# Altium project ALLPRINT-CAPBOARD-677512.PrjPcb (part 1 of 2)
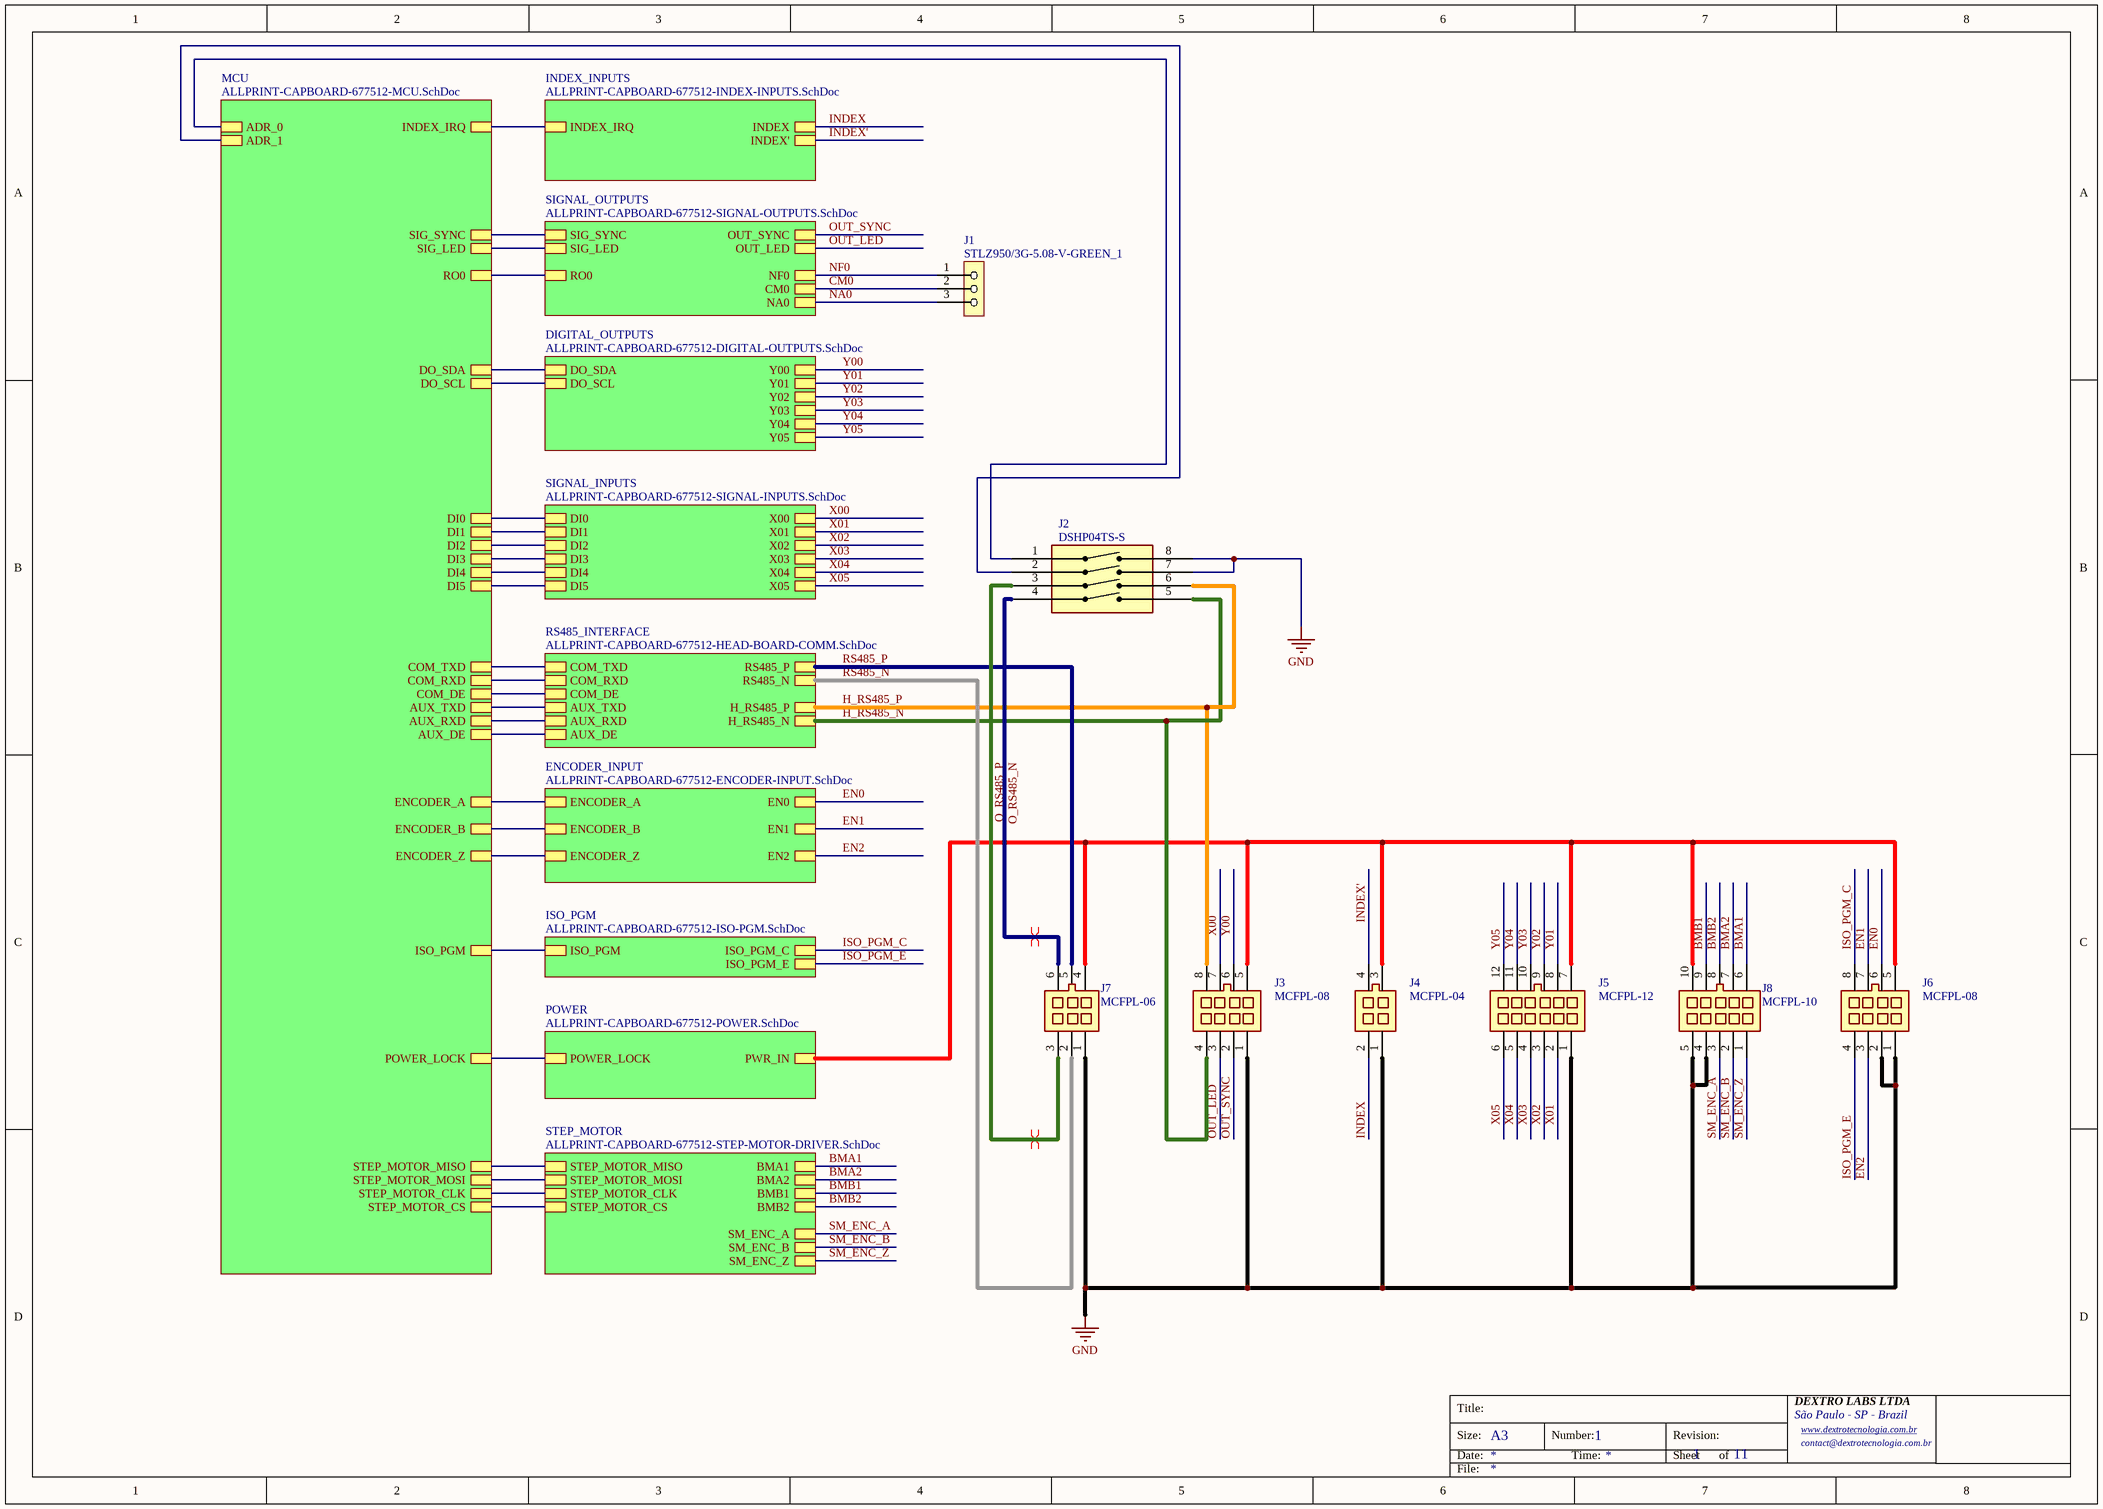
[diagram p0: ALLPRINT-CAPBOARD-677512-GENERAL.SchDoc]
11 sheets, 295 parts. Net scope: hierarchical (ports join the sheet entries above them; power ports are global).
Board file: ALLPRINT-CAPBOARD-677512.PcbDoc
Sheets:
  ALLPRINT-CAPBOARD-677512-GENERAL.SchDoc
    MCU = ALLPRINT-CAPBOARD-677512-MCU.SchDoc
    INDEX_INPUTS = ALLPRINT-CAPBOARD-677512-INDEX-INPUTS.SchDoc
    SIGNAL_INPUTS = ALLPRINT-CAPBOARD-677512-SIGNAL-INPUTS.SchDoc
    SIGNAL_OUTPUTS = ALLPRINT-CAPBOARD-677512-SIGNAL-OUTPUTS.SchDoc
    RS485_INTERFACE = ALLPRINT-CAPBOARD-677512-HEAD-BOARD-COMM.SchDoc
    POWER = ALLPRINT-CAPBOARD-677512-POWER.SchDoc
    DIGITAL_OUTPUTS = ALLPRINT-CAPBOARD-677512-DIGITAL-OUTPUTS.SchDoc
    ENCODER_INPUT = ALLPRINT-CAPBOARD-677512-ENCODER-INPUT.SchDoc
    ISO_PGM = ALLPRINT-CAPBOARD-677512-ISO-PGM.SchDoc
    STEP_MOTOR = ALLPRINT-CAPBOARD-677512-STEP-MOTOR-DRIVER.SchDoc

## Sheet ALLPRINT-CAPBOARD-677512-GENERAL.SchDoc
size A3; Organization: Altium Limited; Address1: 3 Minna Close; Address2: Belrose; Address3: NSW 2085; Address4: Australia; DocumentNumber: 1; SheetNumber: 1; SheetTotal: 11

### Parts
J1  STLZ950/3G-5.08-V-GREEN_1  [STLZ950/3G-5.08-V]
J2  DSHP04TS-S  [SW-SMD_8P-L6.7-W5.4-P1.27-LS8.5]
J3  MCFPL-08  [MCFPL-08]
J4  MCFPL-04  [MCFPL-04]
J5  MCFPL-12  [MCFPL-12]
J6  MCFPL-08  [MCFPL-08]
J7  MCFPL-06  [MCFPL-06]
J8  MCFPL-10  [MCFPL-10]

### Sub-sheets
DIGITAL_OUTPUTS = ALLPRINT-CAPBOARD-677512-DIGITAL-OUTPUTS.SchDoc: Y00, Y01, Y02, Y03, Y04, Y05, DO_SCL, DO_SDA
ENCODER_INPUT = ALLPRINT-CAPBOARD-677512-ENCODER-INPUT.SchDoc: ENCODER_A, ENCODER_B, ENCODER_Z, EN0, EN1, EN2
INDEX_INPUTS = ALLPRINT-CAPBOARD-677512-INDEX-INPUTS.SchDoc: INDEX, INDEX', INDEX_IRQ
ISO_PGM = ALLPRINT-CAPBOARD-677512-ISO-PGM.SchDoc: ISO_PGM, ISO_PGM_C, ISO_PGM_E
MCU = ALLPRINT-CAPBOARD-677512-MCU.SchDoc: INDEX_IRQ, SIG_SYNC, SIG_LED, RO0, DO_SDA, DO_SCL, DI0, DI1, DI2, DI3, DI4, DI5, COM_TXD, COM_RXD, COM_DE, ENCODER_A, ENCODER_B, ENCODER_Z, ISO_PGM, POWER_LOCK, STEP_MOTOR_MISO, STEP_MOTOR_MOSI, STEP_MOTOR_CLK, STEP_MOTOR_CS, AUX_TXD, AUX_RXD, AUX_DE, ADR_0, ADR_1
POWER = ALLPRINT-CAPBOARD-677512-POWER.SchDoc: POWER_LOCK, PWR_IN
RS485_INTERFACE = ALLPRINT-CAPBOARD-677512-HEAD-BOARD-COMM.SchDoc: COM_TXD, COM_RXD, RS485_P, RS485_N, COM_DE, H_RS485_P, H_RS485_N, AUX_TXD, AUX_RXD, AUX_DE
SIGNAL_INPUTS = ALLPRINT-CAPBOARD-677512-SIGNAL-INPUTS.SchDoc: X00, DI0, X01, DI1, X02, DI2, X03, DI3, X04, DI4, X05, DI5
SIGNAL_OUTPUTS = ALLPRINT-CAPBOARD-677512-SIGNAL-OUTPUTS.SchDoc: SIG_SYNC, OUT_SYNC, RO0, CM0, NA0, NF0, SIG_LED, OUT_LED
STEP_MOTOR = ALLPRINT-CAPBOARD-677512-STEP-MOTOR-DRIVER.SchDoc: BMA1, BMA2, BMB1, BMB2, STEP_MOTOR_CLK, STEP_MOTOR_MISO, STEP_MOTOR_MOSI, STEP_MOTOR_CS, SM_ENC_A, SM_ENC_B, SM_ENC_Z

### Nets
GND: J2.7 J2.8 J3.1 J4.1 J5.1 J6.1 J6.2 J7.1 J8.4 J8.5
BMA1: J8.6 ; sheet STEP_MOTOR/BMA1
BMA2: J8.7 ; sheet STEP_MOTOR/BMA2
BMB1: J8.9 ; sheet STEP_MOTOR/BMB1
BMB2: J8.8 ; sheet STEP_MOTOR/BMB2
CLK: sheet MCU/STEP_MOTOR_CLK, sheet STEP_MOTOR/STEP_MOTOR_CLK
CM0: J1.2 ; sheet SIGNAL_OUTPUTS/CM0
CS: sheet MCU/STEP_MOTOR_CS, sheet STEP_MOTOR/STEP_MOTOR_CS
EN0: J6.6 ; sheet ENCODER_INPUT/EN0
EN1: J6.7 ; sheet ENCODER_INPUT/EN1
EN2: J6.3 ; sheet ENCODER_INPUT/EN2
H_RS485_N: J2.5 J3.4 ; sheet RS485_INTERFACE/H_RS485_N
H_RS485_P: J2.6 J3.8 ; sheet RS485_INTERFACE/H_RS485_P
INDEX: J4.2 ; sheet INDEX_INPUTS/INDEX
INDEX': J4.4 ; sheet INDEX_INPUTS/INDEX'
ISO_PGM_C: J6.8 ; sheet ISO_PGM/ISO_PGM_C
ISO_PGM_E: J6.4 ; sheet ISO_PGM/ISO_PGM_E
MISO: sheet MCU/STEP_MOTOR_MISO, sheet STEP_MOTOR/STEP_MOTOR_MISO
MOSI: sheet MCU/STEP_MOTOR_MOSI, sheet STEP_MOTOR/STEP_MOTOR_MOSI
NA0: J1.3 ; sheet SIGNAL_OUTPUTS/NA0
NF0: J1.1 ; sheet SIGNAL_OUTPUTS/NF0
O_RS485_N: J2.4 J7.6
O_RS485_P: J2.3 J7.3
OUT_LED: J3.3 ; sheet SIGNAL_OUTPUTS/OUT_LED
OUT_SYNC: J3.2 ; sheet SIGNAL_OUTPUTS/OUT_SYNC
RS485_N: J7.2 ; sheet RS485_INTERFACE/RS485_N
RS485_P: J7.5 ; sheet RS485_INTERFACE/RS485_P
SM_ENC_A: J8.3 ; sheet STEP_MOTOR/SM_ENC_A
SM_ENC_B: J8.2 ; sheet STEP_MOTOR/SM_ENC_B
SM_ENC_Z: J8.1 ; sheet STEP_MOTOR/SM_ENC_Z
X00: J3.7 ; sheet SIGNAL_INPUTS/X00
X01: J5.2 ; sheet SIGNAL_INPUTS/X01
X02: J5.3 ; sheet SIGNAL_INPUTS/X02
X03: J5.4 ; sheet SIGNAL_INPUTS/X03
X04: J5.5 ; sheet SIGNAL_INPUTS/X04
X05: J5.6 ; sheet SIGNAL_INPUTS/X05
Y00: J3.6 ; sheet DIGITAL_OUTPUTS/Y00
Y01: J5.8 ; sheet DIGITAL_OUTPUTS/Y01
Y02: J5.9 ; sheet DIGITAL_OUTPUTS/Y02
Y03: J5.10 ; sheet DIGITAL_OUTPUTS/Y03
Y04: J5.11 ; sheet DIGITAL_OUTPUTS/Y04
Y05: J5.12 ; sheet DIGITAL_OUTPUTS/Y05
NetF1_1: J3.5 J4.3 J5.7 J6.5 J7.4 J8.10 ; sheet POWER/PWR_IN
NetJ2_1: J2.1 ; sheet MCU/ADR_0
NetJ2_2: J2.2 ; sheet MCU/ADR_1
NetR18_2: sheet MCU/INDEX_IRQ, sheet INDEX_INPUTS/INDEX_IRQ
NetR28_1: sheet MCU/POWER_LOCK, sheet POWER/POWER_LOCK
NetR30_1: sheet MCU/COM_RXD, sheet RS485_INTERFACE/COM_RXD
NetR32_1: sheet MCU/AUX_RXD, sheet RS485_INTERFACE/AUX_RXD
NetR37_2: sheet MCU/SIG_SYNC, sheet SIGNAL_OUTPUTS/SIG_SYNC
NetR42_2: sheet MCU/SIG_LED, sheet SIGNAL_OUTPUTS/SIG_LED
NetR44_1: sheet MCU/RO0, sheet SIGNAL_OUTPUTS/RO0
NetR58_1: sheet MCU/DO_SCL, sheet DIGITAL_OUTPUTS/DO_SCL
NetR59_1: sheet MCU/DO_SDA, sheet DIGITAL_OUTPUTS/DO_SDA
NetR106_1: sheet MCU/ISO_PGM, sheet ISO_PGM/ISO_PGM
NetU1_9: sheet MCU/COM_DE, sheet RS485_INTERFACE/COM_DE
NetU1_10: sheet MCU/COM_TXD, sheet RS485_INTERFACE/COM_TXD
NetU1_12: sheet MCU/DI0, sheet SIGNAL_INPUTS/DI0
NetU1_13: sheet MCU/DI1, sheet SIGNAL_INPUTS/DI1
NetU1_14: sheet MCU/DI2, sheet SIGNAL_INPUTS/DI2
NetU1_15: sheet MCU/DI3, sheet SIGNAL_INPUTS/DI3
NetU1_22: sheet MCU/AUX_TXD, sheet RS485_INTERFACE/AUX_TXD
NetU1_32: sheet MCU/DI4, sheet SIGNAL_INPUTS/DI4
NetU1_33: sheet MCU/DI5, sheet SIGNAL_INPUTS/DI5
NetU1_42: sheet MCU/ENCODER_A, sheet ENCODER_INPUT/ENCODER_A
NetU1_43: sheet MCU/ENCODER_B, sheet ENCODER_INPUT/ENCODER_B
NetU1_45: sheet MCU/ENCODER_Z, sheet ENCODER_INPUT/ENCODER_Z
NetU1_46: sheet MCU/AUX_DE, sheet RS485_INTERFACE/AUX_DE

### Layout directives
differential pair; net class DIFF120; differential pair class DIFF120: O_RS485_N, O_RS485_P

### Notes on the sheet
- Title:
- Size:
- Date:
- A3
- Number:
- Time:
- Revision:
- Sheet
- of
- DEXTRO LABS LTDA
- São Paulo - SP - Brazil
- www.dextrotecnologia.com.br <http://www.dextrotecnologia.com.br>
- contact@dextrotecnologia.com.br
- File:

### Library data of the parts
J1 = STLZ950/3G-5.08-V-GREEN: CONECTOR PHOENIX MECANO 3 VIAS PASSO 5,08mm VERDE 180º
J2 = DSHP04TS-S: 4 24V 25mA SPST 3,000 Cycles Black Slide, Recessed SMD-8P,6.7x5.4mm DIP Switches/SIP Switches ROHS; LCSC: C319050
J3 J6 = MCFPL-08: CONECTOR-METALTEX-PASSO-3mm-90 GRAUS MONTAGEM PLACA-COMPATIVEL MICROFIT-8VIAS / 5A-250VCA
J4 = MCFPL-04: CONECTOR-METALTEX-PASSO-3mm-90 GRAUS MONTAGEM PLACA-COMPATIVEL MICROFIT-4VIAS / 5A-250VCA
J5 = MCFPL-12: CONECTOR-METALTEX-PASSO-3mm-90 GRAUS MONTAGEM PLACA-COMPATIVEL MICROFIT-12VIAS / 5A-250VCA
J7 = MCFPL-06: CONECTOR-METALTEX-PASSO-3mm-90 GRAUS MONTAGEM PLACA-COMPATIVEL MICROFIT-6VIAS / 5A-250VCA
J8 = MCFPL-10: CONECTOR-METALTEX-PASSO-3mm-90 GRAUS MONTAGEM PLACA-COMPATIVEL MICROFIT-10VIAS / 5A-250VCA

## Sheet ALLPRINT-CAPBOARD-677512-MCU.SchDoc
size A3; Organization: Altium Limited; Address1: 3 Minna Close; Address2: Belrose; Address3: NSW 2085; Address4: Australia; DocumentNumber: 3; SheetNumber: 2; SheetTotal: 11
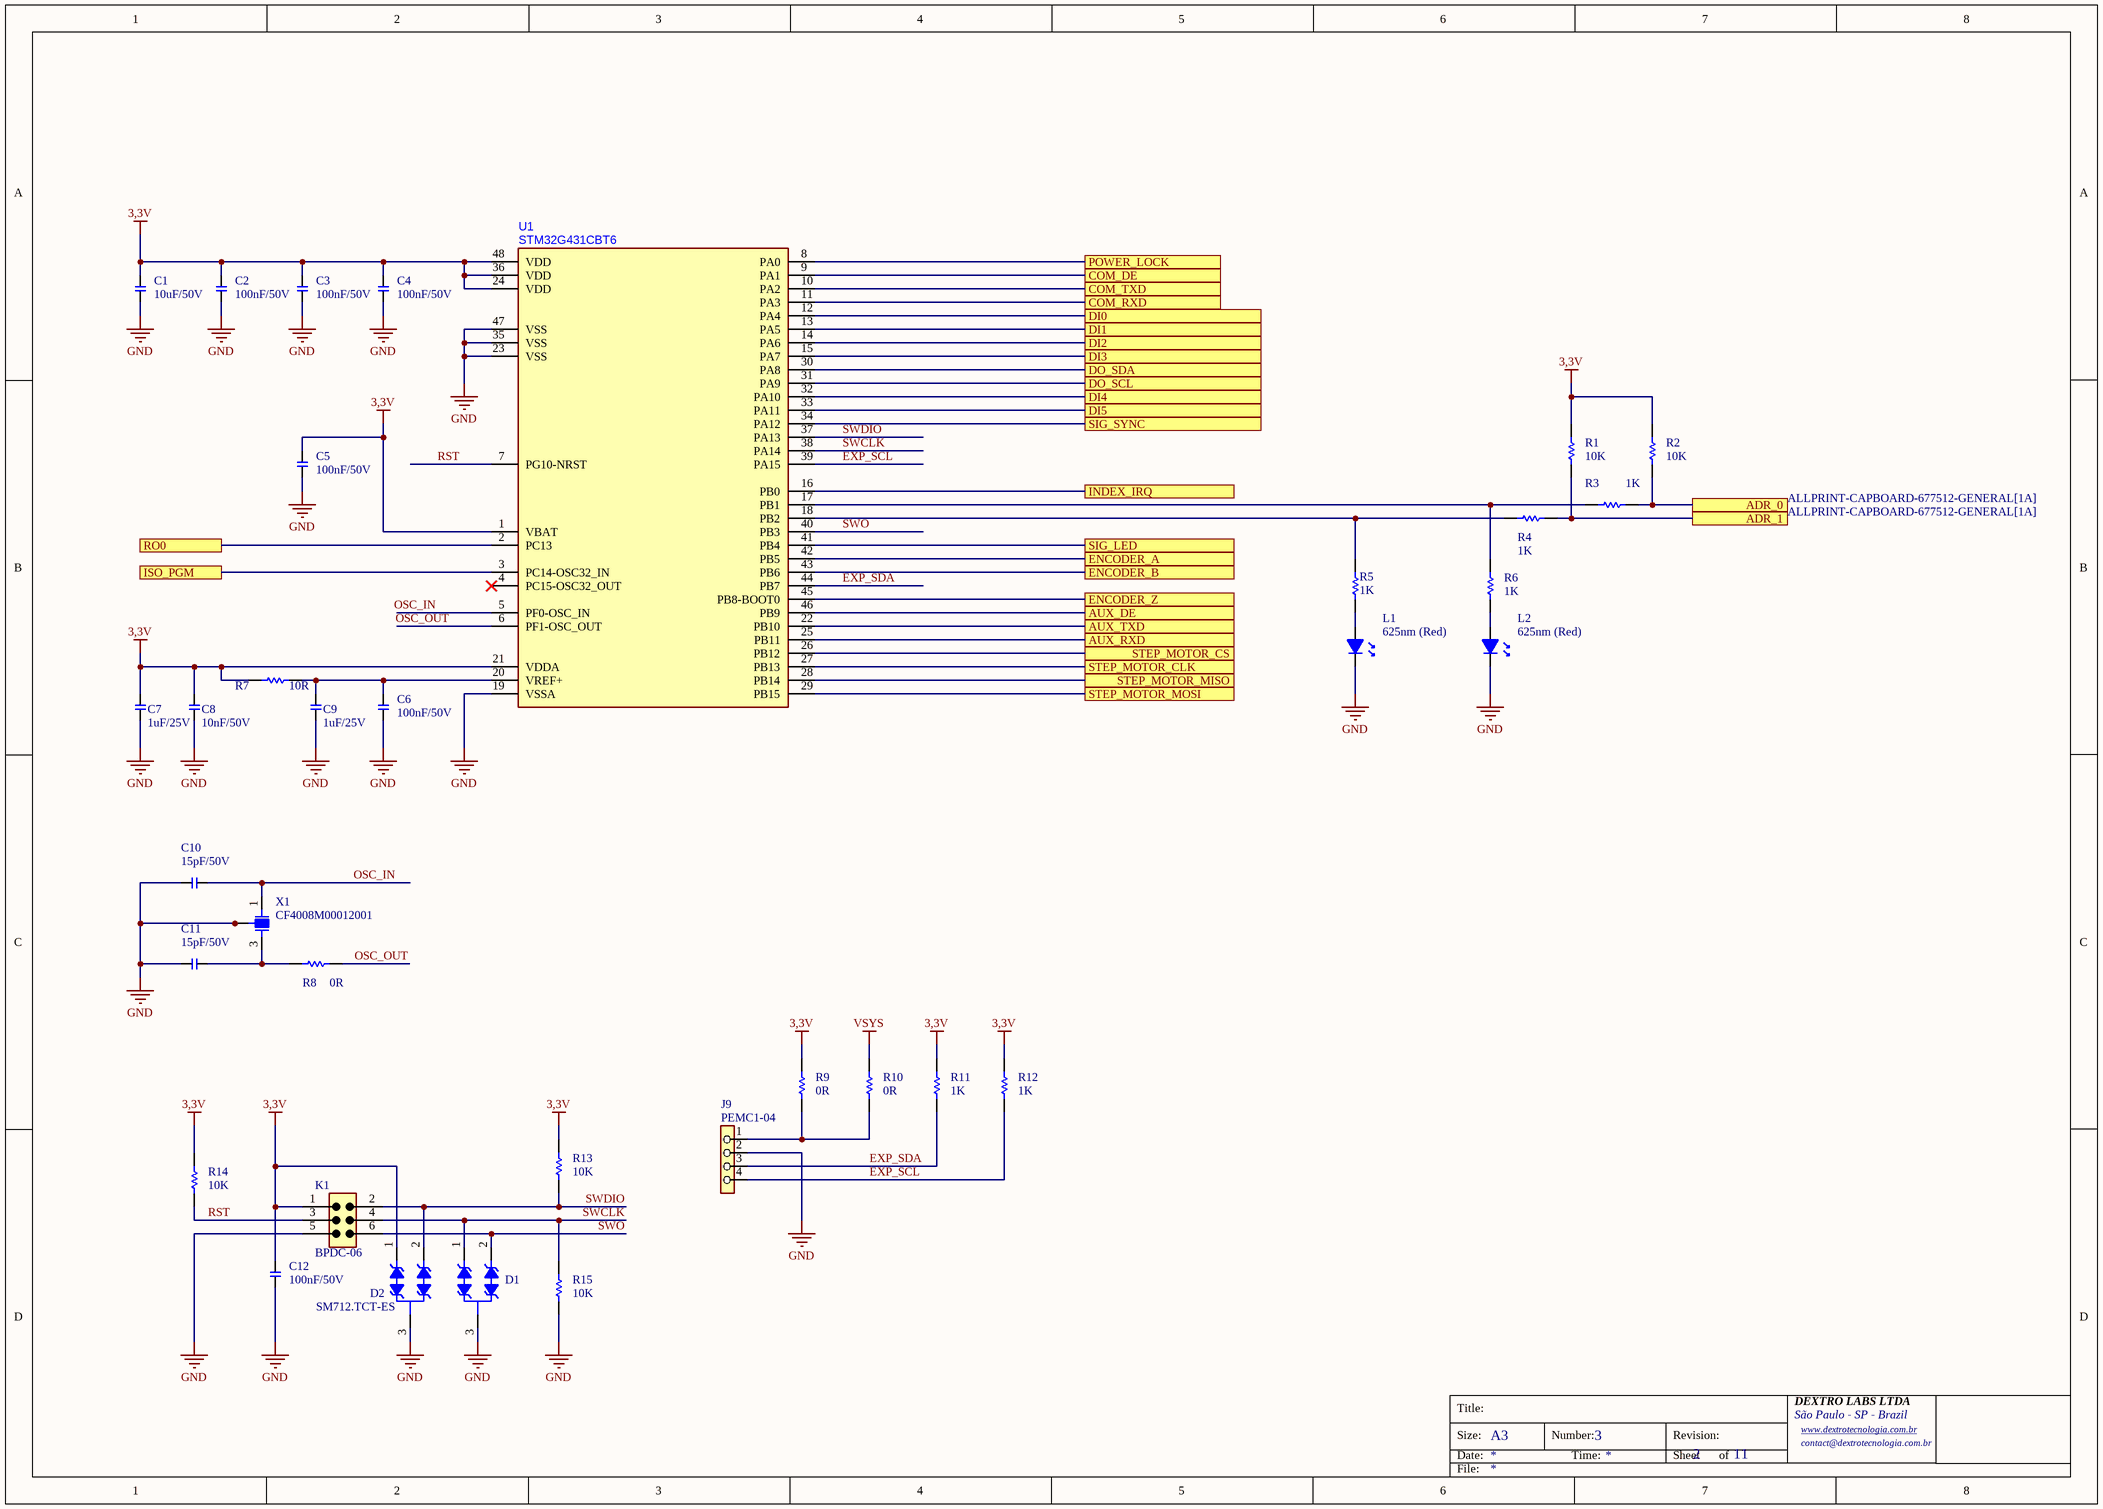
[diagram p1: ALLPRINT-CAPBOARD-677512-MCU.SchDoc]

### Parts
C1  10uF/50V  [CAP-0805]
C2  100nF/50V  [CAP-0603]
C3  100nF/50V  [CAP-0603]
C4  100nF/50V  [CAP-0603]
C5  100nF/50V  [CAP-0603]
C6  100nF/50V  [CAP-0603]
C7  1uF/25V  [CAP-0603]
C8  10nF/50V  [CAP-0603]
C9  1uF/25V  [CAP-0603]
C10  15pF/50V  [CAP-0603]
C11  15pF/50V  [CAP-0603]
C12  100nF/50V  [CAP-0603]
D1  SM712.TCT-ES  [SOT23-3]  (value not drawn)
D2  SM712.TCT-ES  [SOT23-3]
J9  PEMC1-04  [PEMC1-04]
K1  BPDC-06  [BPDC-06]
L1  Wavelength: 625nm (Red)  [LED-SMD-0603]  (hidden comment: YLED0603R)
L2  Wavelength: 625nm (Red)  [LED-SMD-0603]  (hidden comment: YLED0603R)
R1  10K  [RES-0603]
R2  10K  [RES-0603]
R3  1K  [RES-0603]
R4  1K  [RES-0603]
R5  1K  [RES-0603]
R6  1K  [RES-0603]
R7  10R  [RES-0603]
R8  0R  [RES-0603]
R9  0R  [RES-0805]
R10  0R  [RES-0805]
R11  1K  [RES-0603]
R12  1K  [RES-0603]
R13  10K  [RES-0603]
R14  10K  [RES-0603]
R15  10K  [RES-0603]
U1  STM32G431CBT6  [LQFP-48_L7.0-W7.0-P0.50-LS9.0-BL]
X1  CF4008M00012001  [TAXM8M4RDBCCT2T]

### Ports
ADR_0 (see ALLPRINT-CAPBOARD-677512-GENERAL[1A]), ADR_1 (see ALLPRINT-CAPBOARD-677512-GENERAL[1A]), AUX_DE (see ALLPRINT-CAPBOARD-677512-GENERAL[2B], ALLPRINT-CAPBOARD-677512-HEAD-BOARD-COMM[3C]), AUX_RXD (see ALLPRINT-CAPBOARD-677512-GENERAL[2B], ALLPRINT-CAPBOARD-677512-HEAD-BOARD-COMM[3C]), AUX_TXD (see ALLPRINT-CAPBOARD-677512-GENERAL[2B], ALLPRINT-CAPBOARD-677512-HEAD-BOARD-COMM[3C]), COM_DE (see ALLPRINT-CAPBOARD-677512-GENERAL[2B], ALLPRINT-CAPBOARD-677512-HEAD-BOARD-COMM[3B]), COM_RXD (see ALLPRINT-CAPBOARD-677512-GENERAL[2B], ALLPRINT-CAPBOARD-677512-HEAD-BOARD-COMM[3B]), COM_TXD (see ALLPRINT-CAPBOARD-677512-GENERAL[2B], ALLPRINT-CAPBOARD-677512-HEAD-BOARD-COMM[3B]), DI0 (see ALLPRINT-CAPBOARD-677512-GENERAL[2B], ALLPRINT-CAPBOARD-677512-SIGNAL-INPUTS[6A]), DI1 (see ALLPRINT-CAPBOARD-677512-GENERAL[2B], ALLPRINT-CAPBOARD-677512-SIGNAL-INPUTS[6B]), DI2 (see ALLPRINT-CAPBOARD-677512-GENERAL[2B], ALLPRINT-CAPBOARD-677512-SIGNAL-INPUTS[6B]), DI3 (see ALLPRINT-CAPBOARD-677512-GENERAL[2B], ALLPRINT-CAPBOARD-677512-SIGNAL-INPUTS[6C]), DI4 (see ALLPRINT-CAPBOARD-677512-GENERAL[2B], ALLPRINT-CAPBOARD-677512-SIGNAL-INPUTS[6C]), DI5 (see ALLPRINT-CAPBOARD-677512-GENERAL[2B], ALLPRINT-CAPBOARD-677512-SIGNAL-INPUTS[6D]), DO_SCL (see ALLPRINT-CAPBOARD-677512-GENERAL[2B], ALLPRINT-CAPBOARD-677512-DIGITAL-OUTPUTS[1B]), DO_SDA (see ALLPRINT-CAPBOARD-677512-GENERAL[2A], ALLPRINT-CAPBOARD-677512-DIGITAL-OUTPUTS[1B]), ENCODER_A (see ALLPRINT-CAPBOARD-677512-GENERAL[2C], ALLPRINT-CAPBOARD-677512-ENCODER-INPUT[6B]), ENCODER_B (see ALLPRINT-CAPBOARD-677512-GENERAL[2C], ALLPRINT-CAPBOARD-677512-ENCODER-INPUT[6B]), ENCODER_Z (see ALLPRINT-CAPBOARD-677512-GENERAL[2C], ALLPRINT-CAPBOARD-677512-ENCODER-INPUT[6C]), INDEX_IRQ (see ALLPRINT-CAPBOARD-677512-GENERAL[2A], ALLPRINT-CAPBOARD-677512-INDEX-INPUTS[7B]), ISO_PGM (see ALLPRINT-CAPBOARD-677512-GENERAL[2C], ALLPRINT-CAPBOARD-677512-ISO-PGM[3B]), POWER_LOCK (see ALLPRINT-CAPBOARD-677512-GENERAL[2C], ALLPRINT-CAPBOARD-677512-POWER[2D]), RO0 (see ALLPRINT-CAPBOARD-677512-GENERAL[2A], ALLPRINT-CAPBOARD-677512-SIGNAL-OUTPUTS[1D]), SIG_LED (see ALLPRINT-CAPBOARD-677512-GENERAL[2A], ALLPRINT-CAPBOARD-677512-SIGNAL-OUTPUTS[2B]), SIG_SYNC (see ALLPRINT-CAPBOARD-677512-GENERAL[2A], ALLPRINT-CAPBOARD-677512-SIGNAL-OUTPUTS[2A]), STEP_MOTOR_CLK (see ALLPRINT-CAPBOARD-677512-GENERAL[2D], ALLPRINT-CAPBOARD-677512-STEP-MOTOR-DRIVER[1A]), STEP_MOTOR_CS (see ALLPRINT-CAPBOARD-677512-GENERAL[2D], ALLPRINT-CAPBOARD-677512-STEP-MOTOR-DRIVER[1A]), STEP_MOTOR_MISO (see ALLPRINT-CAPBOARD-677512-GENERAL[2D], ALLPRINT-CAPBOARD-677512-STEP-MOTOR-DRIVER[1A]), STEP_MOTOR_MOSI (see ALLPRINT-CAPBOARD-677512-GENERAL[2D], ALLPRINT-CAPBOARD-677512-STEP-MOTOR-DRIVER[1A])

### Nets
3,3V: C1.2 C2.2 C3.2 C4.2 C5.2 C7.2 C8.2 C12.2 D2.1(A1) K1.1 R1.2 R2.2 R7.1 R9.2 R11.2 R12.2 R13.2 R14.2 U1.1(VBAT) U1.21(VDDA) U1.24(VDD) U1.36(VDD) U1.48(VDD)
GND: C1.1 C2.1 C3.1 C4.1 C5.1 C6.1 C7.1 C8.1 C9.1 C10.1 C11.1 C12.1 D1.3(K) D2.3(K) J9.2 K1.5 L1.1(K) L2.1(K) R15.1 U1.19(VSSA) U1.23(VSS) U1.35(VSS) U1.47(VSS) X1.2 X1.4
VSYS: R10.2
CLK: U1.27(PB13) ; port STEP_MOTOR_CLK
CS: U1.26(PB12) ; port STEP_MOTOR_CS
EXP_SCL: J9.4 R12.1 U1.39(PA15)
EXP_SDA: J9.3 R11.1 U1.44(PB7)
MISO: U1.28(PB14) ; port STEP_MOTOR_MISO
MOSI: U1.29(PB15) ; port STEP_MOTOR_MOSI
OSC_IN: C10.2 U1.5(PF0-OSC_IN) X1.1
OSC_OUT: R8.2 U1.6(PF1-OSC_OUT)
RST: K1.3 R14.1 U1.7(PG10-NRST)
SWCLK: D1.1(A1) K1.4 R15.2 U1.38(PA14)
SWDIO: D2.2(A2) K1.2 R13.1 U1.37(PA13)
SWO: D1.2(A2) K1.6 U1.40(PB3)
NetC6_2: C6.2 C9.2 R7.2 U1.20(VREF+)
NetC11_2: C11.2 R8.1 X1.3
NetJ2_1: R2.1 R3.2 ; port ADR_0
NetJ2_2: R1.1 R4.2 ; port ADR_1
NetJ9_1: J9.1 R9.1 R10.1
NetL1_2: L1.2(A) R5.2
NetL2_2: L2.2(A) R6.1
NetR3_1: R3.1 R6.2 U1.17(PB1)
NetR4_1: R4.1 R5.1 U1.18(PB2)
NetR18_2: U1.16(PB0) ; port INDEX_IRQ
NetR28_1: U1.8(PA0) ; port POWER_LOCK
NetR30_1: U1.11(PA3) ; port COM_RXD
NetR32_1: U1.25(PB11) ; port AUX_RXD
NetR37_2: U1.34(PA12) ; port SIG_SYNC
NetR42_2: U1.41(PB4) ; port SIG_LED
NetR44_1: U1.2(PC13) ; port RO0
NetR58_1: U1.31(PA9) ; port DO_SCL
NetR59_1: U1.30(PA8) ; port DO_SDA
NetR106_1: U1.3(PC14-OSC32_IN) ; port ISO_PGM
NetU1_9: U1.9(PA1) ; port COM_DE
NetU1_10: U1.10(PA2) ; port COM_TXD
NetU1_12: U1.12(PA4) ; port DI0
NetU1_13: U1.13(PA5) ; port DI1
NetU1_14: U1.14(PA6) ; port DI2
NetU1_15: U1.15(PA7) ; port DI3
NetU1_22: U1.22(PB10) ; port AUX_TXD
NetU1_32: U1.32(PA10) ; port DI4
NetU1_33: U1.33(PA11) ; port DI5
NetU1_42: U1.42(PB5) ; port ENCODER_A
NetU1_43: U1.43(PB6) ; port ENCODER_B
NetU1_45: U1.45(PB8-BOOT0) ; port ENCODER_Z
NetU1_46: U1.46(PB9) ; port AUX_DE

Not connected (* = marked no-connect by the designer): U1 4(PC15-OSC32_OUT)*

### Notes on the sheet
- Title:
- Size:
- Date:
- A3
- Number:
- Time:
- Revision:
- Sheet
- of
- DEXTRO LABS LTDA
- São Paulo - SP - Brazil
- www.dextrotecnologia.com.br <http://www.dextrotecnologia.com.br>
- contact@dextrotecnologia.com.br
- File:

### Library data of the parts
C1 = CAP-10uF/50V-0805-X5R-MLCC: 50V 10uF X5R ±10% 1206 Multilayer Ceramic Capacitors MLCC - SMD/SMT ROHS; LCSC: C13585
C2-C6 C12 = CAP-100nF/50V-0603-X7R-MLCC: 50V 100nF X7R ±10% 0603 Multilayer Ceramic Capacitors MLCC - SMD/SMT ROHS; LCSC: C14663
C7 C9 = CAP-1uF/25V-0603-X7R-MLCC: 25V 1uF X7R ±10% 0603 Multilayer Ceramic Capacitors MLCC - SMD/SMT ROHS; LCSC: C29936
C8 = CAP-10nF/50V-0603-X7R-MLCC: 50V 10nF X7R ±10% 0603 Multilayer Ceramic Capacitors MLCC - SMD/SMT ROHS; LCSC: C1589
C10 C11 = CAP-15pF/50V-0603-NP0-MLCC: 50V 15pF NP0 ±5% 0603 Ceramic Capacitors RoHS; LCSC: C107037
D1 D2 = SM712.TCT-ES: 400W@8/20us Bidirectional SOT-23 ESD and Surge Protection (TVS/ESD) ROHS; LCSC: C22363671
J9 = PEMC1-04: CONECTOR PASSO 2,5mm / 250VCA / 3A / 10mOHMS
K1 = BPDC-06: BARRA DE PINOS DUPLA 2,54mm 6 VIAS 180º
L1 L2 = D-LED-SMD-PKG@0603-RED: 25mA 120mcd 620nm~625nm Red 1.8V~2.4V 0603 LED Indication - Discrete RoHS; Part Number: YLED0603R; LCSC: C19171390
R1 R2 R13-R15 = RES-10K-1%-100mW-0603: 100mW Thick Film Resistor 75V ±100ppm/℃ ±1% 10kΩ 0603 Chip Resistor - Surface Mount ROHS; LCSC: C98220
R3-R6 R11 R12 = RES-1K-1%-100mW-0603: 100mW Thick Film Resistor 75V ±100ppm/℃ ±1% 1kΩ 0603 Chip Resistor - Surface Mount ROHS; LCSC: C22548
R7 = RES-10R-1%-100mW-0603: 100mW Thick Film Resistor 75V ±1% ±400ppm/℃ 10Ω 0603 Chip Resistor - Surface Mount ROHS; LCSC: C22859
R8 = RES-0R-1%-100mW-0603: 100mW 0Ω 75V Thick Film Resistor ±5% 0603 Chip Resistor - Surface Mount RoHS; LCSC: C95177
R9 R10 = RES-0R-1%-125mW-0805: 100mW Thick Film Resistor 75V ±100ppm/℃ ±1% 0R Chip Resistor - Surface Mount ROHS; LCSC: C17477
U1 = STM32G431CBT6: Manufacturer: ST(意法半导体); Add into BOM: yes; CPU Core: ARM Cortex-M Series; CPU Maximum Speed: 170MHz; Program Storage Size: 128KB; Program Memory Type: FLASH; Number of I/O: 38; ADC (Bit): 12bit; Voltage - Supply: 1.71V~3.6V; Symbol: STM32G431CBT6; Device: STM32G431CBT6; Supplier Part: C529355; Manufacturer Part: STM32G431CBT6; Supplier Footprint: LQFP-48(7x7); JLCPCB Part Class: Extended Part; Datasheet: https://item.szlcsc.com/datasheet/STM32G431CBT6/549633.html; Supplier: LCSC; Convert to PCB: yes; DAC (Bit): 12bit; Applications: -; LCSC: C529355
X1 = XTAL-8MHZ-3225-SMD: Crystal Oscillator 12pF SMD3225-4P Crystals RoHS; LCSC: C7294546

## Sheet ALLPRINT-CAPBOARD-677512-INDEX-INPUTS.SchDoc
size A3; Organization: Altium Limited; Address1: 3 Minna Close; Address2: Belrose; Address3: NSW 2085; Address4: Australia; DocumentNumber: 4; SheetNumber: 3; SheetTotal: 11
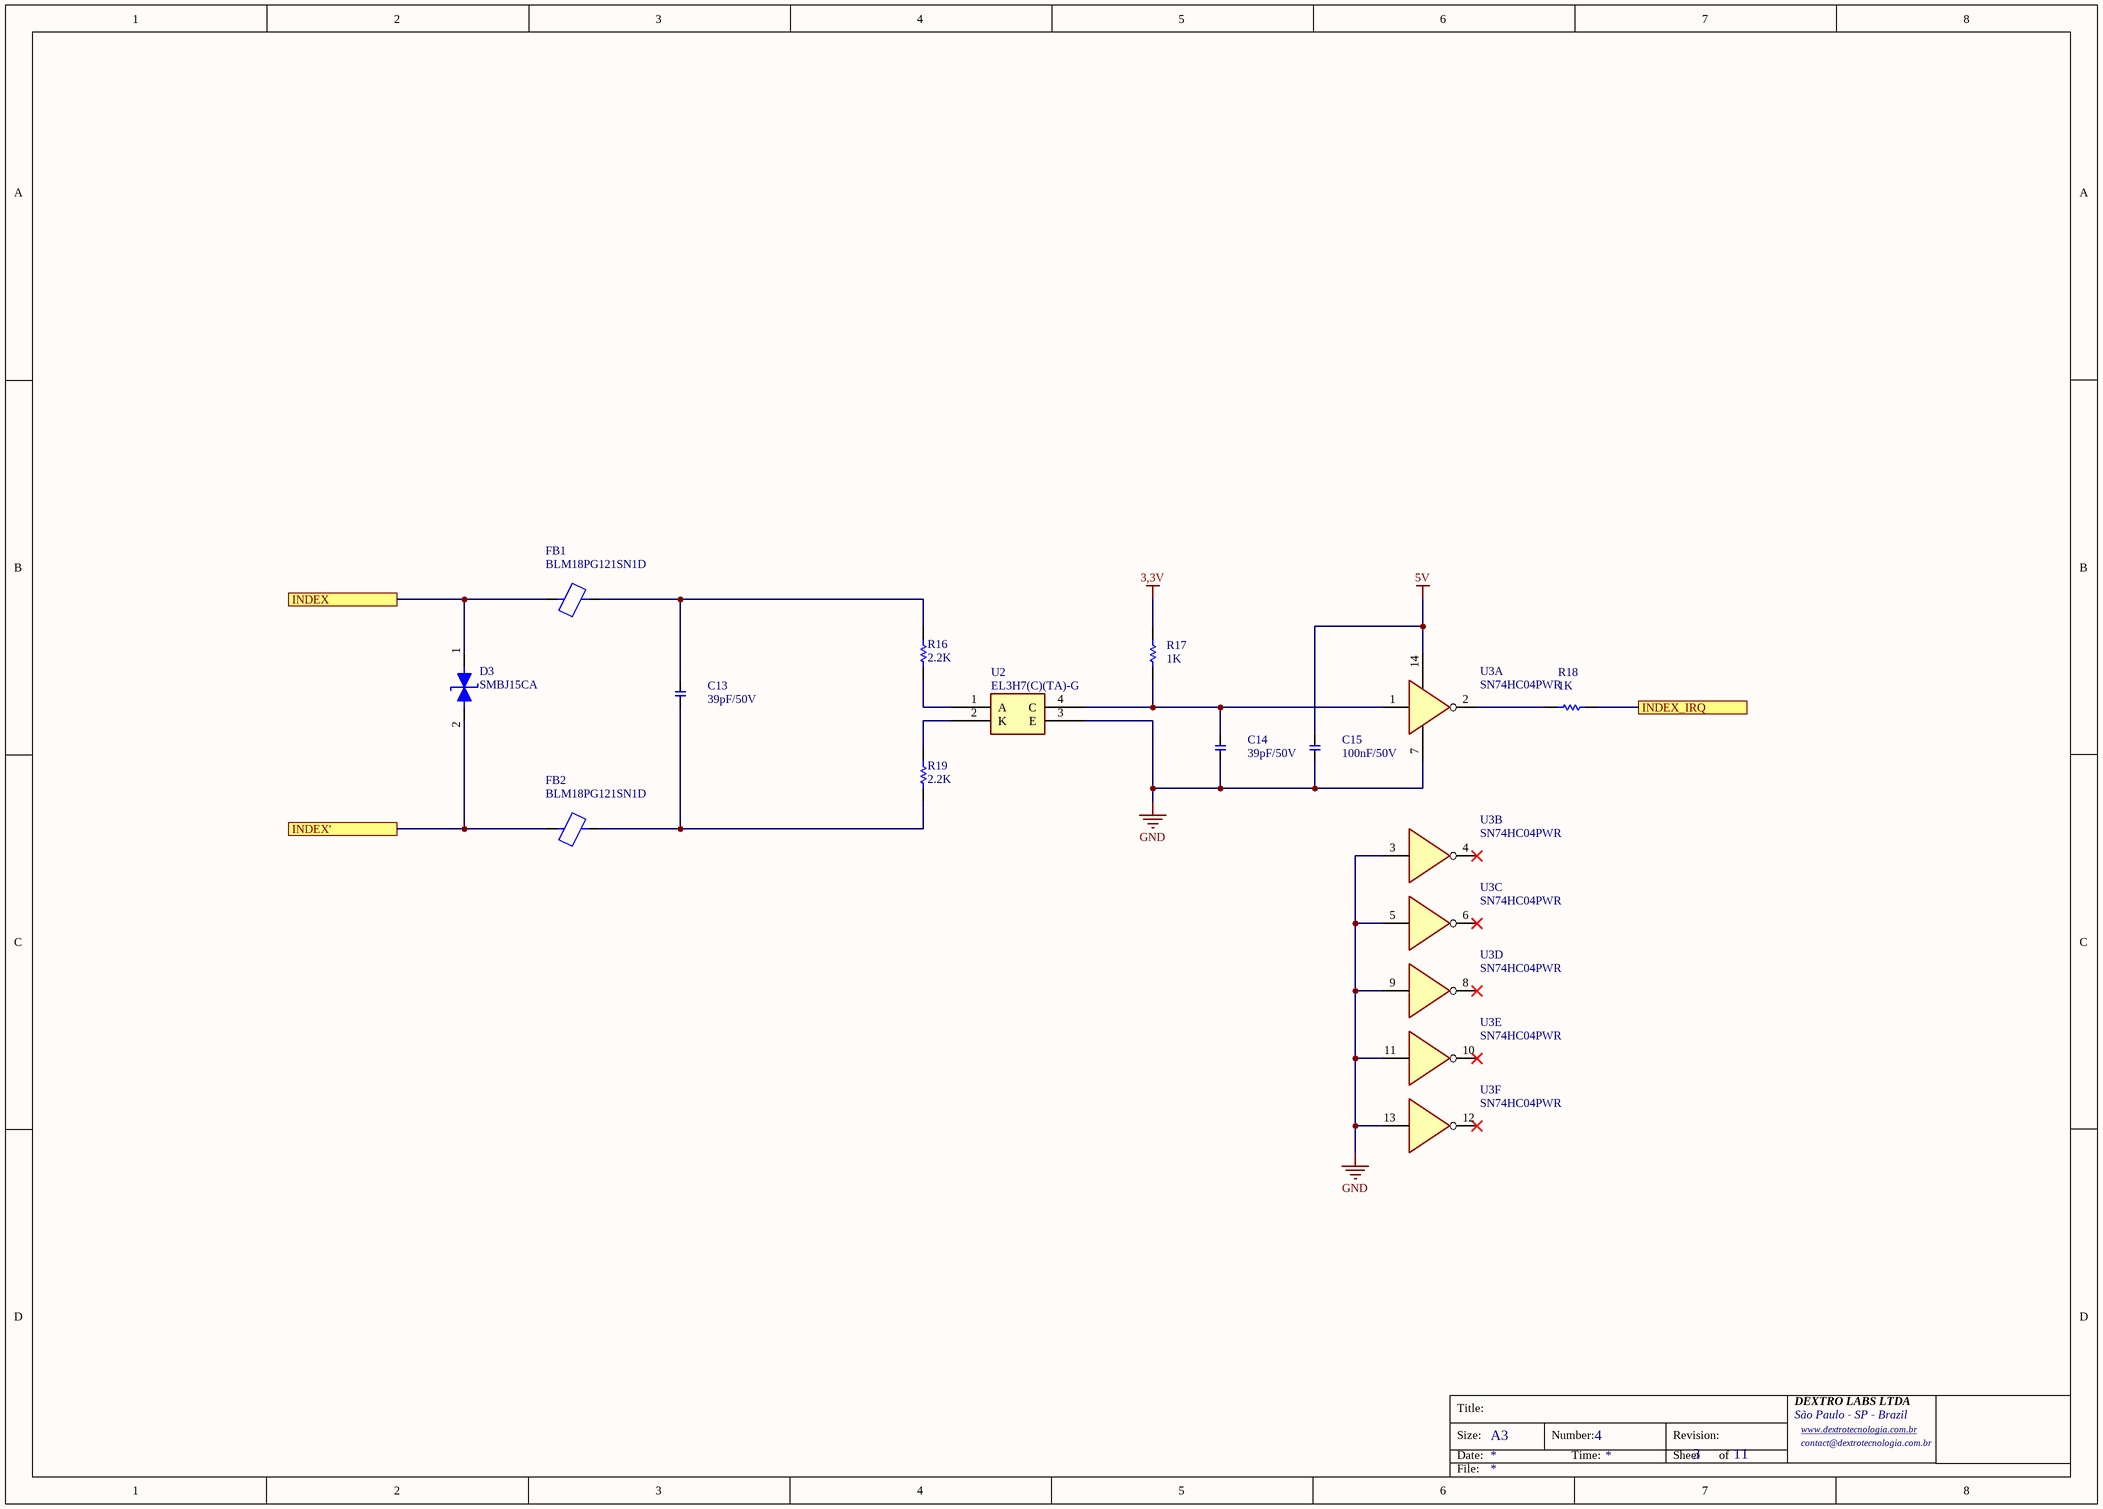
[diagram p2: ALLPRINT-CAPBOARD-677512-INDEX-INPUTS.SchDoc]

### Parts
C13  39pF/50V  [CAP-0603]
C14  39pF/50V  [CAP-0603]
C15  100nF/50V  [CAP-0603]
D3  SMBJ15CA  [DO214-AA]
FB1  BLM18PG121SN1D  [RES-0603]
FB2  BLM18PG121SN1D  [RES-0603]
R16  2.2K  [RES-0805]
R17  1K  [RES-0805]
R18  1K  [RES-0805]
R19  2.2K  [RES-0805]
U2  EL3H7(C)(TA)-G  [SSOP-4]
U3  SN74HC04PWR  [TSSOP-14]  (parts A,B,C,D,E,F of 6)

### Ports
INDEX (see ALLPRINT-CAPBOARD-677512-GENERAL[4A]), INDEX' (see ALLPRINT-CAPBOARD-677512-GENERAL[4A]), INDEX_IRQ (see ALLPRINT-CAPBOARD-677512-GENERAL[3A], ALLPRINT-CAPBOARD-677512-MCU[5B])

### Nets
3,3V: R17.2
5V: C15.2 U3.14(VCC)
GND: C14.1 C15.1 U2.3(E) U3.3(4A) U3.5 U3.7(GND) U3.9 U3.11 U3.13
INDEX: D3.1(A1) FB1.1 ; port INDEX
INDEX': D3.2(A2) FB2.1 ; port INDEX'
NetC13_1: C13.1 FB2.2 R19.1
NetC13_2: C13.2 FB1.2 R16.2
NetC14_2: C14.2 R17.1 U2.4(C) U3.1(1A)
NetR16_1: R16.1 U2.1(A)
NetR18_1: R18.1 U3.2
NetR18_2: R18.2 ; port INDEX_IRQ
NetR19_2: R19.2 U2.2(K)

Not connected (* = marked no-connect by the designer): U3 4(4Y)* 6* 8* 10* 12*

### Notes on the sheet
- Title:
- Size:
- Date:
- A3
- Number:
- Time:
- Revision:
- Sheet
- of
- DEXTRO LABS LTDA
- São Paulo - SP - Brazil
- www.dextrotecnologia.com.br <http://www.dextrotecnologia.com.br>
- contact@dextrotecnologia.com.br
- File:

### Library data of the parts
C13 C14 = CAP-39pF/50V-0603-X7R-MLCC: 50V 39pF X7R ±10% 0603 Multilayer Ceramic Capacitors MLCC - SMD/SMT ROHS; LCSC: C107049
C15 = CAP-100nF/50V-0603-X7R-MLCC: as C2 on sheet ALLPRINT-CAPBOARD-677512-MCU; LCSC: C14663
D3 = SMBJ15CA: 24.6A 600W@8/20us 24.4V 19.2V Bidirectional 15V SMB(DO-214AA) ESD and Surge Protection (TVS/ESD) ROHS; LCSC: C2760879
FB1 FB2 = BLM18PG121SN1D: FERRITE BEAD 120Ω 0603 1LN; LCSC: C14709
R16 R19 = RES-2.2K-1%-125mW-0805: 125mW 2.2kΩ 150V ±100ppm/℃ Thick Film Resistor ±1% 0805 Chip Resistor - Surface Mount ROHS; LCSC: C2907234
R17 R18 = RES-1K-1%-125mW-0805: 125mW Thick Film Resistor 150V ±100ppm/℃ ±1% 1kΩ 0805 Chip Resistor - Surface Mount ROHS; LCSC: C17513
U2 = EL3H7(C)(TA)-G: 80V 3.75kV 50mA 200mV@10mA,1mA 6V 1.2V DC SSOP-4-1.27mm Transistor, Photovoltaic Output Optoisolators ROHS; LCSC: C92243
U3 = SN74HC04PWR: 2V~6V 16ns@6V,50pF 2uA 6 1 TSSOP-14 Gates and Inverters RoHS; LCSC: C6810

## Sheet ALLPRINT-CAPBOARD-677512-SIGNAL-INPUTS.SchDoc
size A3; Organization: Altium Limited; Address1: 3 Minna Close; Address2: Belrose; Address3: NSW 2085; Address4: Australia; DocumentNumber: 8; SheetNumber: 7; SheetTotal: 11
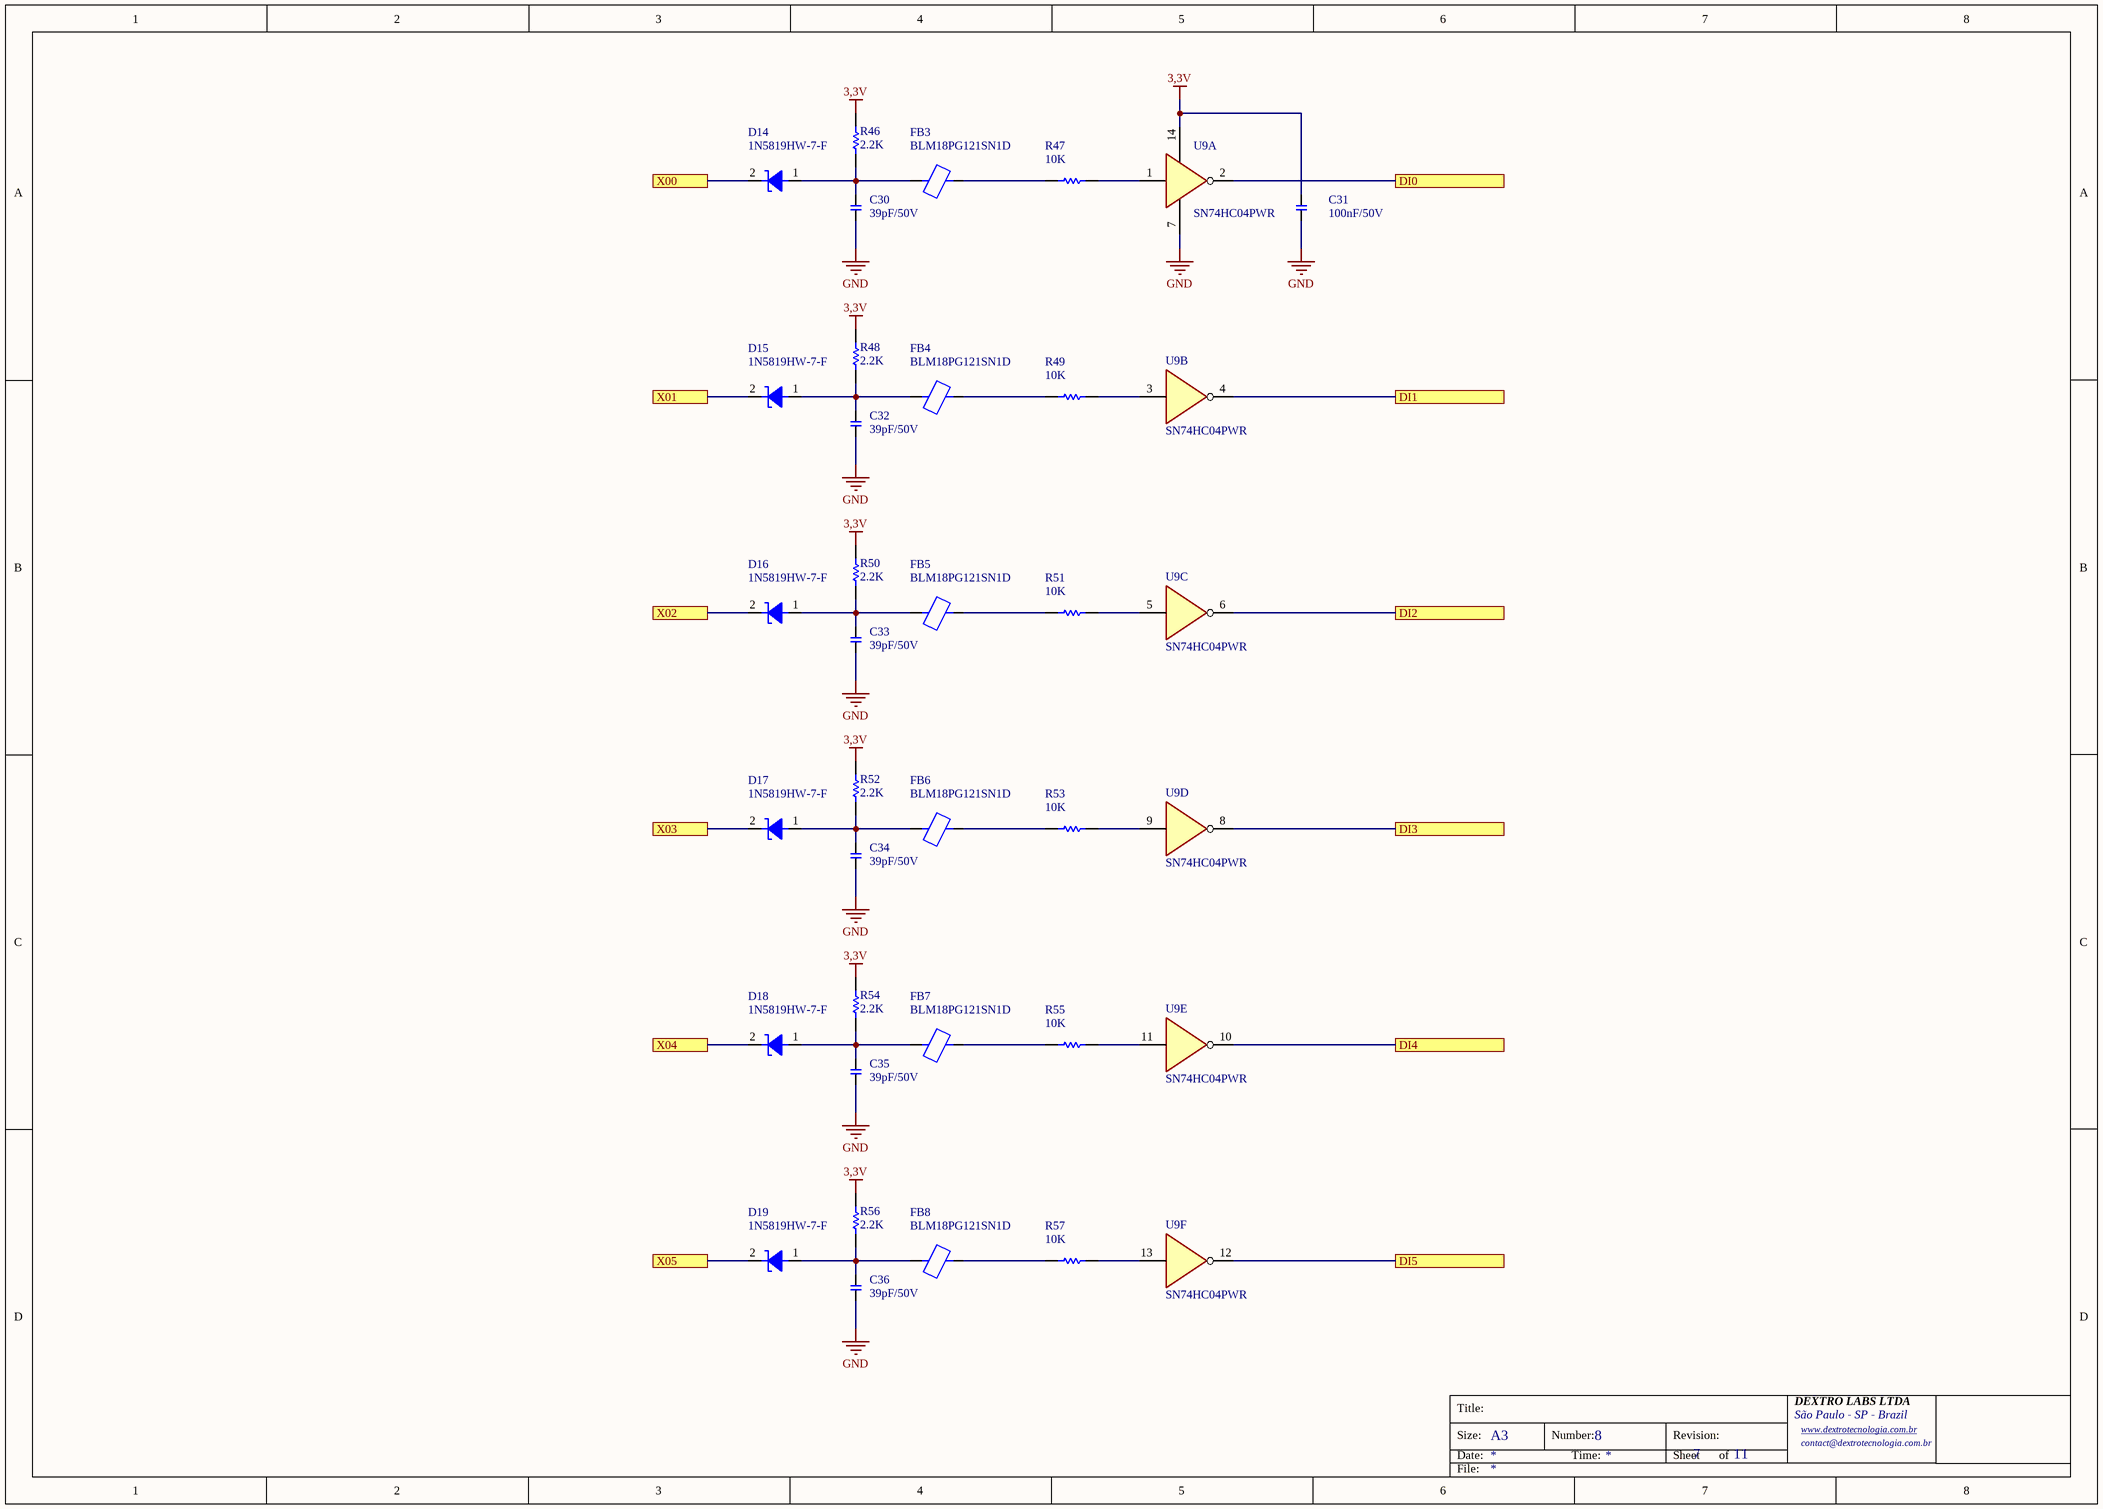
[diagram p3: ALLPRINT-CAPBOARD-677512-SIGNAL-INPUTS.SchDoc]

### Parts
C30  39pF/50V  [CAP-0603]
C31  100nF/50V  [CAP-0603]
C32  39pF/50V  [CAP-0603]
C33  39pF/50V  [CAP-0603]
C34  39pF/50V  [CAP-0603]
C35  39pF/50V  [CAP-0603]
C36  39pF/50V  [CAP-0603]
D14  1N5819HW-7-F  [SOD123]
D15  1N5819HW-7-F  [SOD123]
D16  1N5819HW-7-F  [SOD123]
D17  1N5819HW-7-F  [SOD123]
D18  1N5819HW-7-F  [SOD123]
D19  1N5819HW-7-F  [SOD123]
FB3  BLM18PG121SN1D  [RES-0603]
FB4  BLM18PG121SN1D  [RES-0603]
FB5  BLM18PG121SN1D  [RES-0603]
FB6  BLM18PG121SN1D  [RES-0603]
FB7  BLM18PG121SN1D  [RES-0603]
FB8  BLM18PG121SN1D  [RES-0603]
R46  2.2K  [RES-0805]
R47  10K  [RES-0603]
R48  2.2K  [RES-0805]
R49  10K  [RES-0603]
R50  2.2K  [RES-0805]
R51  10K  [RES-0603]
R52  2.2K  [RES-0805]
R53  10K  [RES-0603]
R54  2.2K  [RES-0805]
R55  10K  [RES-0603]
R56  2.2K  [RES-0805]
R57  10K  [RES-0603]
U9  SN74HC04PWR  [TSSOP-14]  (parts A,B,C,D,E,F of 6)

### Ports
DI0 (see ALLPRINT-CAPBOARD-677512-GENERAL[3B], ALLPRINT-CAPBOARD-677512-MCU[5A]), DI1 (see ALLPRINT-CAPBOARD-677512-GENERAL[3B], ALLPRINT-CAPBOARD-677512-MCU[5A]), DI2 (see ALLPRINT-CAPBOARD-677512-GENERAL[3B], ALLPRINT-CAPBOARD-677512-MCU[5A]), DI3 (see ALLPRINT-CAPBOARD-677512-GENERAL[3B], ALLPRINT-CAPBOARD-677512-MCU[5A]), DI4 (see ALLPRINT-CAPBOARD-677512-GENERAL[3B], ALLPRINT-CAPBOARD-677512-MCU[5B]), DI5 (see ALLPRINT-CAPBOARD-677512-GENERAL[3B], ALLPRINT-CAPBOARD-677512-MCU[5B]), X00 (see ALLPRINT-CAPBOARD-677512-GENERAL[4B]), X01 (see ALLPRINT-CAPBOARD-677512-GENERAL[4B]), X02 (see ALLPRINT-CAPBOARD-677512-GENERAL[4B]), X03 (see ALLPRINT-CAPBOARD-677512-GENERAL[4B]), X04 (see ALLPRINT-CAPBOARD-677512-GENERAL[4B]), X05 (see ALLPRINT-CAPBOARD-677512-GENERAL[4B])

### Nets
3,3V: C31.2 R46.1 R48.1 R50.1 R52.1 R54.1 R56.1 U9.14(VCC)
GND: C30.1 C31.1 C32.1 C33.1 C34.1 C35.1 C36.1 U9.7(GND)
X00: D14.2 ; port X00
X01: D15.2 ; port X01
X02: D16.2 ; port X02
X03: D17.2 ; port X03
X04: D18.2 ; port X04
X05: D19.2 ; port X05
NetC30_2: C30.2 D14.1 FB3.1 R46.2
NetC32_2: C32.2 D15.1 FB4.1 R48.2
NetC33_2: C33.2 D16.1 FB5.1 R50.2
NetC34_2: C34.2 D17.1 FB6.1 R52.2
NetC35_2: C35.2 D18.1 FB7.1 R54.2
NetC36_2: C36.2 D19.1 FB8.1 R56.2
NetFB3_2: FB3.2 R47.1
NetFB4_2: FB4.2 R49.1
NetFB5_2: FB5.2 R51.1
NetFB6_2: FB6.2 R53.1
NetFB7_2: FB7.2 R55.1
NetFB8_2: FB8.2 R57.1
NetR47_2: R47.2 U9.1(1A)
NetR49_2: R49.2 U9.3(2A)
NetR51_2: R51.2 U9.5(3A)
NetR53_2: R53.2 U9.9(4A)
NetR55_2: R55.2 U9.11(5A)
NetR57_2: R57.2 U9.13(6A)
NetU1_12: U9.2(1Y) ; port DI0
NetU1_13: U9.4(2Y) ; port DI1
NetU1_14: U9.6(3Y) ; port DI2
NetU1_15: U9.8(4Y) ; port DI3
NetU1_32: U9.10(5Y) ; port DI4
NetU1_33: U9.12(6Y) ; port DI5

### Notes on the sheet
- Title:
- Size:
- Date:
- A3
- Number:
- Time:
- Revision:
- Sheet
- of
- DEXTRO LABS LTDA
- São Paulo - SP - Brazil
- www.dextrotecnologia.com.br <http://www.dextrotecnologia.com.br>
- contact@dextrotecnologia.com.br
- File:

### Library data of the parts
C30 C32-C36 = CAP-39pF/50V-0603-X7R-MLCC: as C13 on sheet ALLPRINT-CAPBOARD-677512-INDEX-INPUTS; LCSC: C107049
C31 = CAP-100nF/50V-0603-X7R-MLCC: as C2 on sheet ALLPRINT-CAPBOARD-677512-MCU; LCSC: C14663
D14-D19 = 1N5819HW-7-F: 25A 1 Independent 40V 450mV@1A 1A SOD-123 Single Diodes RoHS; LCSC: C82544
FB3-FB8 = BLM18PG121SN1D: FERRITE BEAD 120Ω 0603 1LN; LCSC: C14709
R46 R48 R50 R52 R54 R56 = RES-2.2K-1%-125mW-0805: as R16 on sheet ALLPRINT-CAPBOARD-677512-INDEX-INPUTS; LCSC: C2907234
R47 R49 R51 R53 R55 R57 = RES-10K-1%-100mW-0603: as R1 on sheet ALLPRINT-CAPBOARD-677512-MCU; LCSC: C98220
U9 = SN74HC04PWR: as U3 on sheet ALLPRINT-CAPBOARD-677512-INDEX-INPUTS; LCSC: C6810

## Sheet ALLPRINT-CAPBOARD-677512-SIGNAL-OUTPUTS.SchDoc
size A3; Organization: Altium Limited; Address1: 3 Minna Close; Address2: Belrose; Address3: NSW 2085; Address4: Australia; DocumentNumber: 7; SheetNumber: 6; SheetTotal: 11
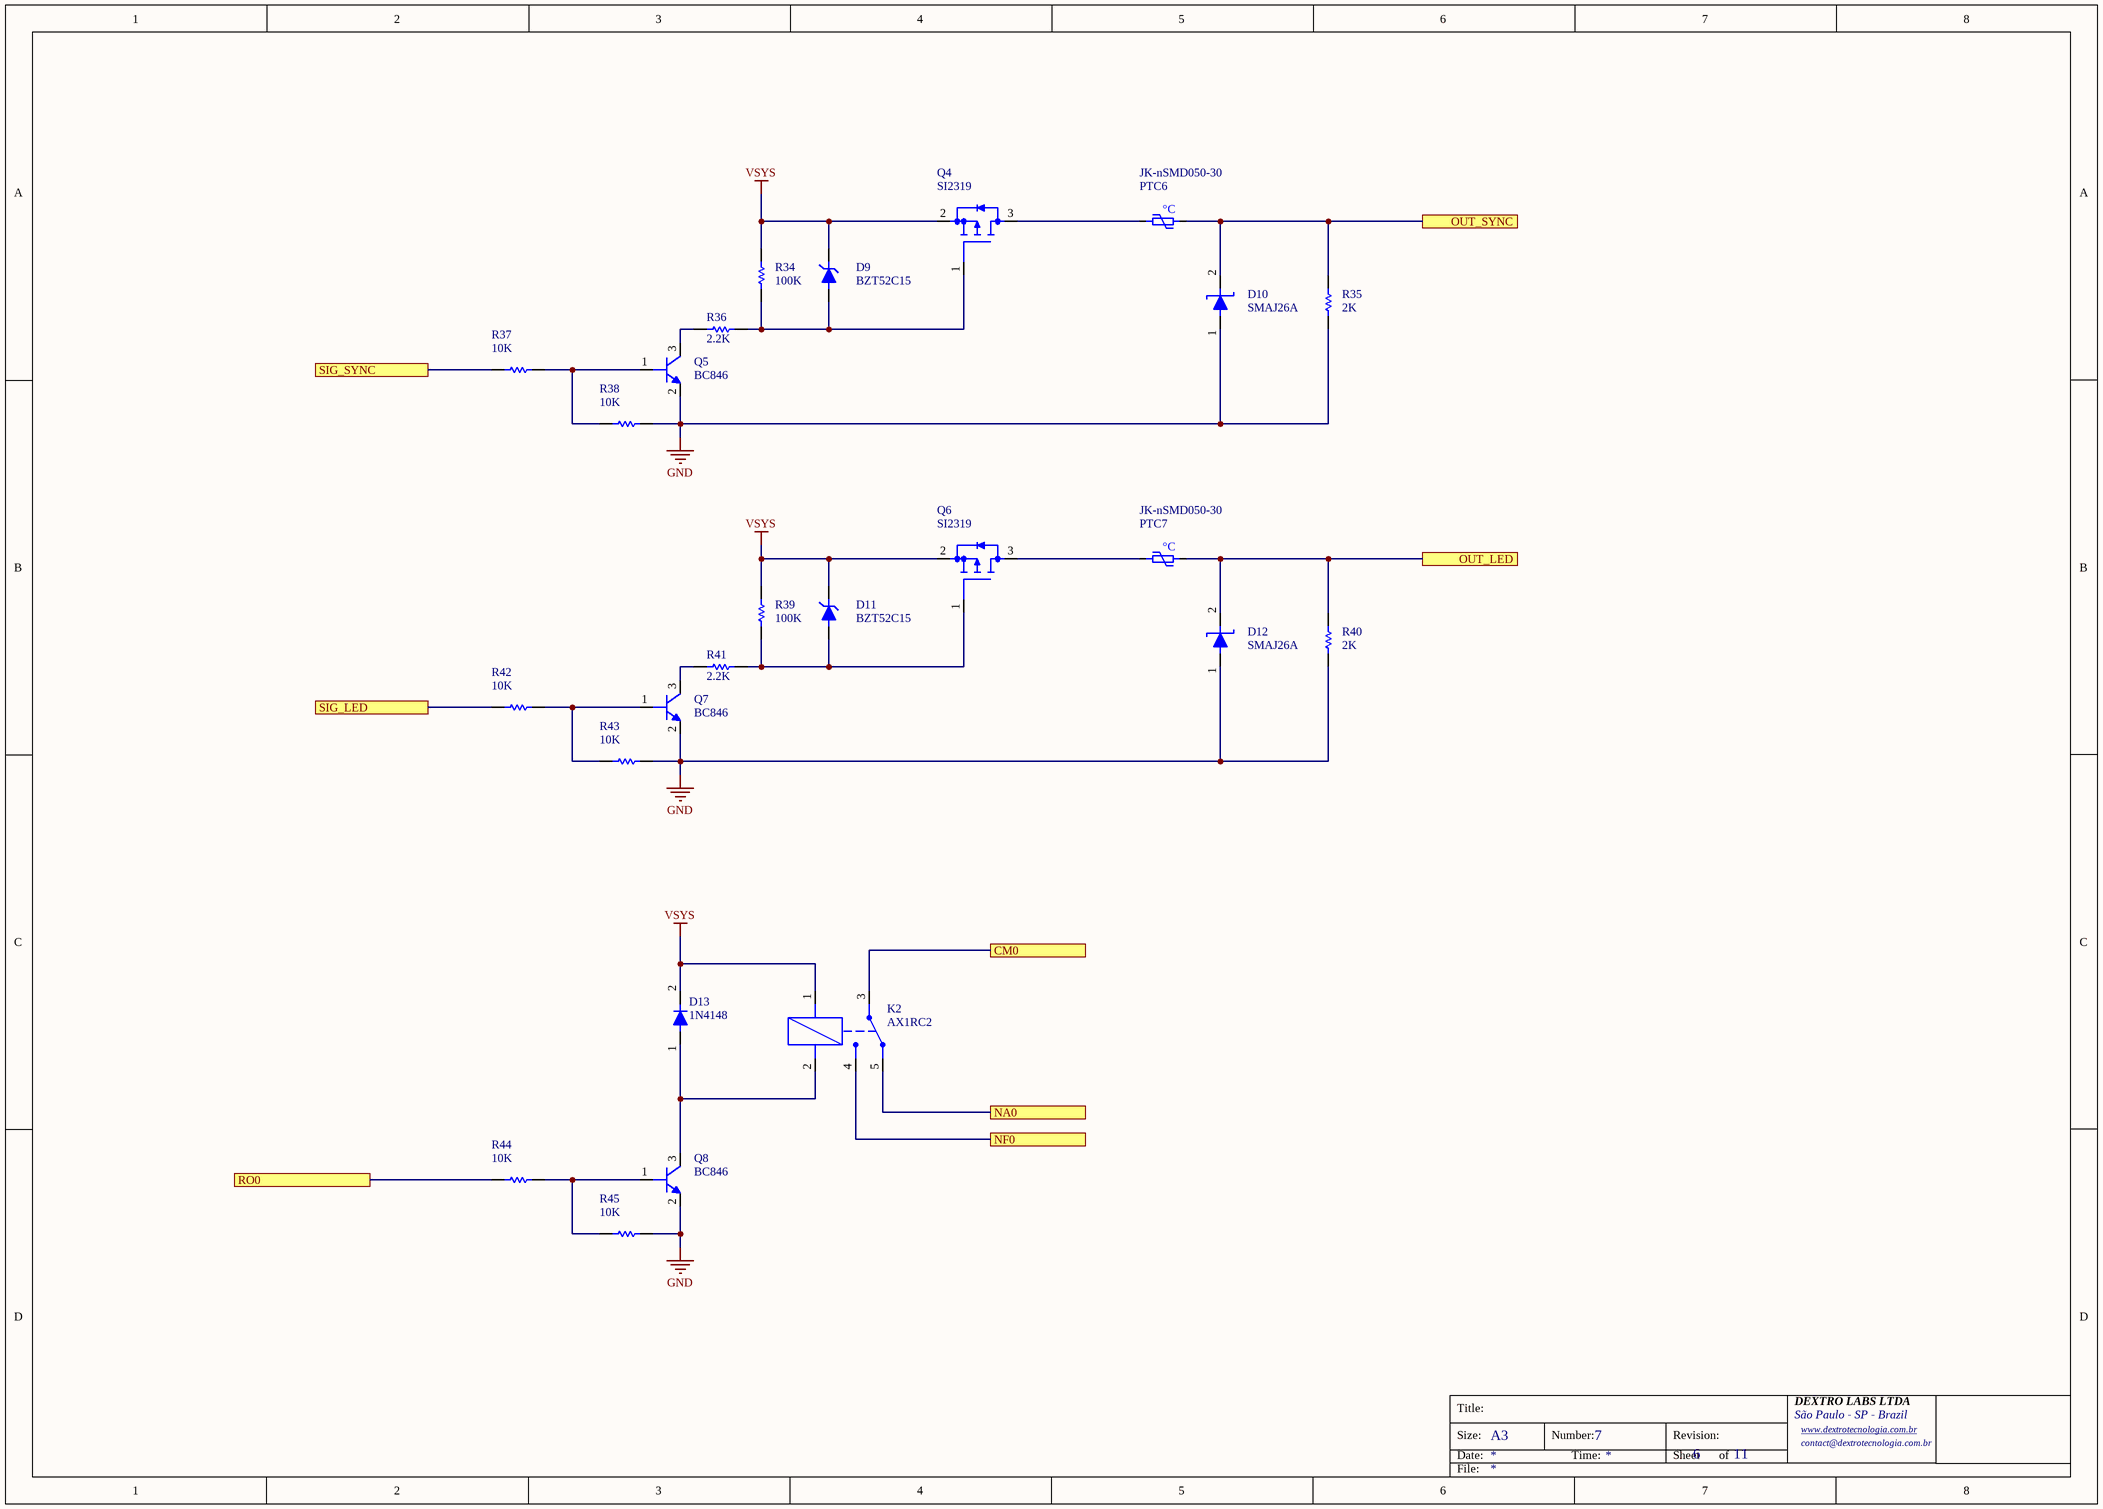
[diagram p4: ALLPRINT-CAPBOARD-677512-SIGNAL-OUTPUTS.SchDoc]

### Parts
D9  BZT52C15  [SOD123]
D10  SMAJ26A  [DO214-AC (SMA)]
D11  BZT52C15  [SOD123]
D12  SMAJ26A  [DO214-AC (SMA)]
D13  1N4148  [SOD123]
K2  AX1RC2  [METALTEX-AX1]
PTC6  JK-nSMD050-30  [PTC-1206]
PTC7  JK-nSMD050-30  [PTC-1206]
Q4  SI2319  [SOT23-3]
Q5  BC846  [SOT23-3]
Q6  SI2319  [SOT23-3]
Q7  BC846  [SOT23-3]
Q8  BC846  [SOT23-3]
R34  100K  [RES-0603]
R35  2K  [RES-1206]
R36  2.2K  [RES-0805]
R37  10K  [RES-0603]
R38  10K  [RES-0603]
R39  100K  [RES-0603]
R40  2K  [RES-1206]
R41  2.2K  [RES-0805]
R42  10K  [RES-0603]
R43  10K  [RES-0603]
R44  10K  [RES-0603]
R45  10K  [RES-0603]

### Ports
CM0 (see ALLPRINT-CAPBOARD-677512-GENERAL[4A]), NA0 (see ALLPRINT-CAPBOARD-677512-GENERAL[4A]), NF0 (see ALLPRINT-CAPBOARD-677512-GENERAL[4A]), OUT_LED (see ALLPRINT-CAPBOARD-677512-GENERAL[4A]), OUT_SYNC (see ALLPRINT-CAPBOARD-677512-GENERAL[4A]), RO0 (see ALLPRINT-CAPBOARD-677512-GENERAL[3A], ALLPRINT-CAPBOARD-677512-MCU[1B]), SIG_LED (see ALLPRINT-CAPBOARD-677512-GENERAL[3A], ALLPRINT-CAPBOARD-677512-MCU[5B]), SIG_SYNC (see ALLPRINT-CAPBOARD-677512-GENERAL[3A], ALLPRINT-CAPBOARD-677512-MCU[5B])

### Nets
GND: D10.1(A) D12.1(A) Q5.2 Q7.2 Q8.2 R35.1 R38.1 R40.1 R43.1 R45.2
VSYS: D9.2 D11.2 D13.2(K) K2.1 Q4.2(S) Q6.2(S) R34.2 R39.2
CM0: K2.3 ; port CM0
NA0: K2.5 ; port NA0
NF0: K2.4 ; port NF0
OUT_LED: D12.2(K) PTC7.2 R40.2 ; port OUT_LED
OUT_SYNC: D10.2(K) PTC6.2 R35.2 ; port OUT_SYNC
NetD9_1: D9.1 Q4.1(G]) R34.1 R36.1
NetD11_1: D11.1 Q6.1(G]) R39.1 R41.1
NetD13_1: D13.1(A1) K2.2 Q8.3
NetPTC6_1: PTC6.1 Q4.3(D)
NetPTC7_1: PTC7.1 Q6.3(D)
NetQ5_1: Q5.1 R37.1 R38.2
NetQ5_3: Q5.3 R36.2
NetQ7_1: Q7.1 R42.1 R43.2
NetQ7_3: Q7.3 R41.2
NetQ8_1: Q8.1 R44.2 R45.1
NetR37_2: R37.2 ; port SIG_SYNC
NetR42_2: R42.2 ; port SIG_LED
NetR44_1: R44.1 ; port RO0

### Notes on the sheet
- Title:
- Size:
- Date:
- A3
- Number:
- Time:
- Revision:
- Sheet
- of
- DEXTRO LABS LTDA
- São Paulo - SP - Brazil
- www.dextrotecnologia.com.br <http://www.dextrotecnologia.com.br>
- contact@dextrotecnologia.com.br
- File:
- (in symbol PTC-FUSE-30V-500mA-1206) °C

### Library data of the parts
D9 D11 = BZT52C15: DIODO ZENER 15V-500mW-SOD123; LCSC: C266569
D10 D12 = SMAJ26A: 28.9V 26V 9.5A 42.1V 400W Unidirectional DO-214AC(SMA) TVS Diodes RoHS; LCSC: C2848697
D13 = 1N4148: 1A 4ns 75V Independent 1V@50mA 150mA SOD-123 Single Diodes RoHS; LCSC: C241939
K2 = AX1RC2: RELÉ-METALTEX-BOBINA 12V-15A-SPDT
PTC6 PTC7 = PTC-FUSE-30V-500mA-1206: 30V 500mA 100A 1A 150mΩ 1206 PTC Resettable Fuses ROHS; LCSC: C720075
Q4 Q6 = SI2319: P-Channel 40V 5A 1.4W Surface Mount SOT-23; LCSC: C5337197
Q5 Q7 Q8 = TRANSISTOR-BC846B,215-SOT23: 65V 200@10mA,5V 250mW 100mA NPN SOT-23 Bipolar (BJT) ROHS; LCSC: C87062
R34 R39 = RES-100K-1%-100mW-0603: 100mW Thick Film Resistor 75V ±100ppm/℃ ±1% 100kΩ 0603 Chip Resistor - Surface Mount ROHS; LCSC: C14675
R35 R40 = RES-2K-1%-250mW-1206: 250mW Thick Film Resistor 200V ±100ppm/℃ ±5% 2kΩ 1206 Chip Resistor - Surface Mount ROHS; LCSC: C2907466
R36 R41 = RES-2.2K-1%-125mW-0805: as R16 on sheet ALLPRINT-CAPBOARD-677512-INDEX-INPUTS; LCSC: C2907234
R37 R38 R42-R45 = RES-10K-1%-100mW-0603: as R1 on sheet ALLPRINT-CAPBOARD-677512-MCU; LCSC: C98220

## Sheet ALLPRINT-CAPBOARD-677512-HEAD-BOARD-COMM.SchDoc
size A3; Organization: Altium Limited; Address1: 3 Minna Close; Address2: Belrose; Address3: NSW 2085; Address4: Australia; DocumentNumber: 6; SheetNumber: 5; SheetTotal: 11
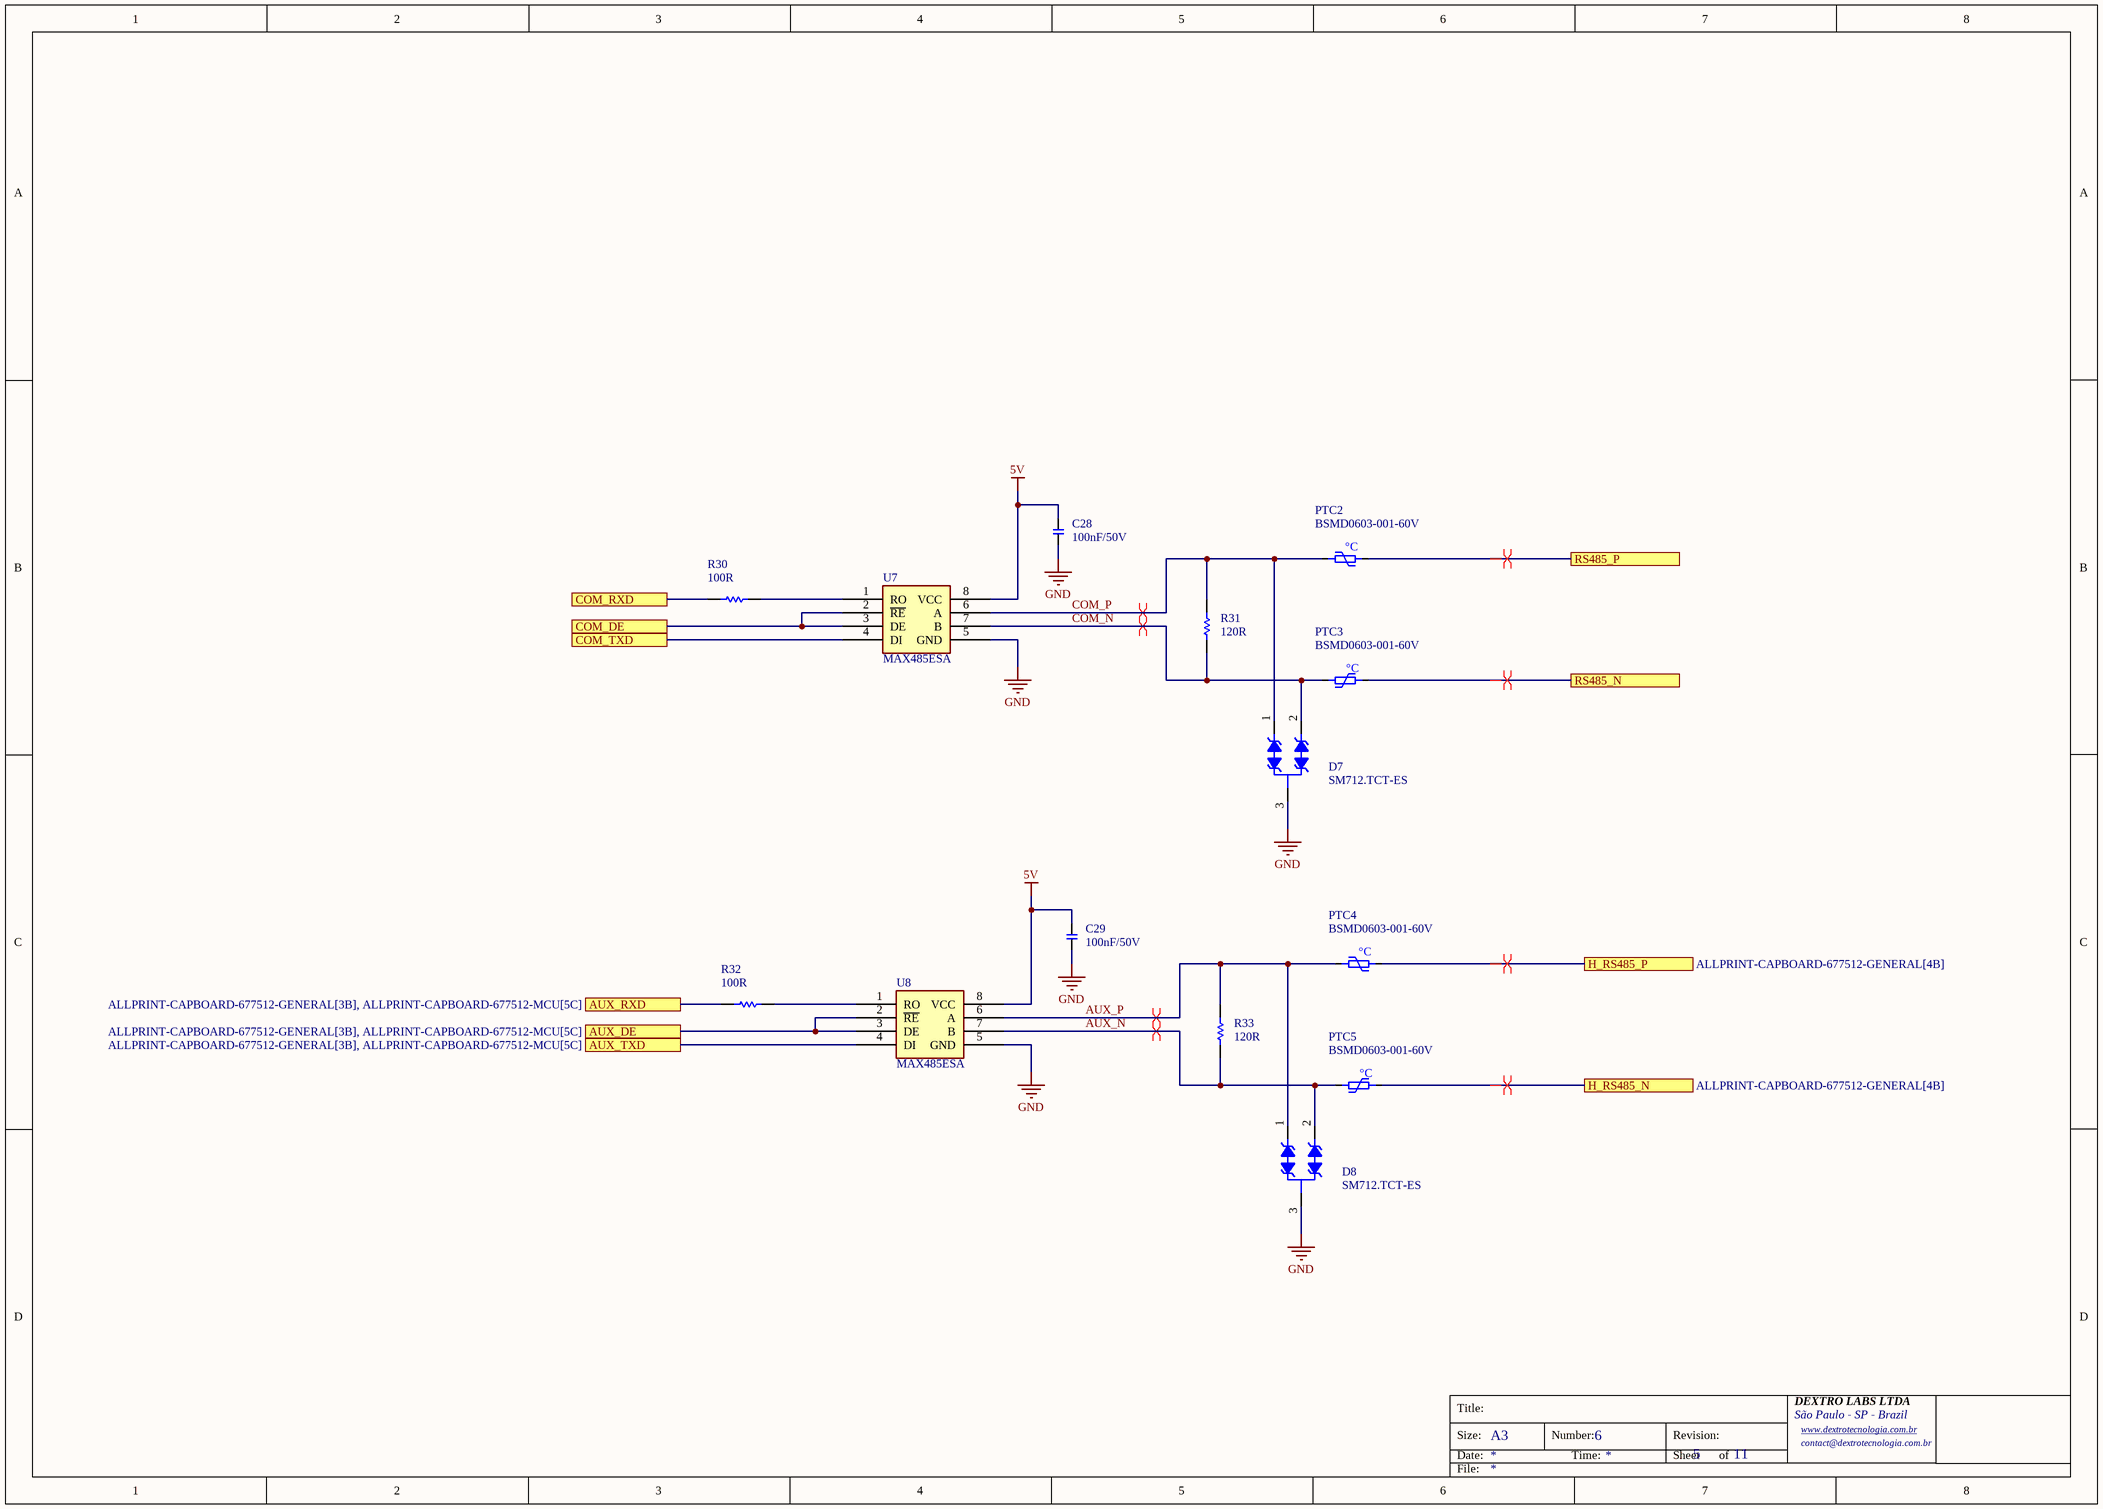
[diagram p5: ALLPRINT-CAPBOARD-677512-HEAD-BOARD-COMM.SchDoc]

### Parts
C28  100nF/50V  [CAP-0603]
C29  100nF/50V  [CAP-0603]
D7  SM712.TCT-ES  [SOT23-3]
D8  SM712.TCT-ES  [SOT23-3]
PTC2  BSMD0603-001-60V  [PTC-0603]
PTC3  BSMD0603-001-60V  [PTC-0603]
PTC4  BSMD0603-001-60V  [PTC-0603]
PTC5  BSMD0603-001-60V  [PTC-0603]
R30  100R  [RES-0603]
R31  120R  [RES-1206]
R32  100R  [RES-0603]
R33  120R  [RES-1206]
U7  MAX485ESA  [SOIC-08]
U8  MAX485ESA  [SOIC-08]

### Ports
AUX_DE (see ALLPRINT-CAPBOARD-677512-GENERAL[3B], ALLPRINT-CAPBOARD-677512-MCU[5C]), AUX_RXD (see ALLPRINT-CAPBOARD-677512-GENERAL[3B], ALLPRINT-CAPBOARD-677512-MCU[5C]), AUX_TXD (see ALLPRINT-CAPBOARD-677512-GENERAL[3B], ALLPRINT-CAPBOARD-677512-MCU[5C]), COM_DE (see ALLPRINT-CAPBOARD-677512-GENERAL[3B], ALLPRINT-CAPBOARD-677512-MCU[5A]), COM_RXD (see ALLPRINT-CAPBOARD-677512-GENERAL[3B], ALLPRINT-CAPBOARD-677512-MCU[5A]), COM_TXD (see ALLPRINT-CAPBOARD-677512-GENERAL[3B], ALLPRINT-CAPBOARD-677512-MCU[5A]), H_RS485_N (see ALLPRINT-CAPBOARD-677512-GENERAL[4B]), H_RS485_P (see ALLPRINT-CAPBOARD-677512-GENERAL[4B]), RS485_N (see ALLPRINT-CAPBOARD-677512-GENERAL[4B]), RS485_P (see ALLPRINT-CAPBOARD-677512-GENERAL[4B])

### Nets
5V: C28.2 C29.2 U7.8(VCC) U8.8(VCC)
GND: C28.1 C29.1 D7.3(K) D8.3(K) U7.5(GND) U8.5(GND)
AUX_N: D8.2(A2) PTC5.2 R33.1 U8.7(B)
AUX_P: D8.1(A1) PTC4.1 R33.2 U8.6(A)
COM_N: D7.2(A2) PTC3.2 R31.1 U7.7(B)
COM_P: D7.1(A1) PTC2.1 R31.2 U7.6(A)
H_RS485_N: PTC5.1 ; port H_RS485_N
H_RS485_P: PTC4.2 ; port H_RS485_P
RS485_N: PTC3.1 ; port RS485_N
RS485_P: PTC2.2 ; port RS485_P
NetR30_1: R30.1 ; port COM_RXD
NetR30_2: R30.2 U7.1(RO)
NetR32_1: R32.1 ; port AUX_RXD
NetR32_2: R32.2 U8.1(RO)
NetU1_9: U7.2(~{RE}) U7.3(DE) ; port COM_DE
NetU1_10: U7.4(DI) ; port COM_TXD
NetU1_22: U8.4(DI) ; port AUX_TXD
NetU1_46: U8.2(~{RE}) U8.3(DE) ; port AUX_DE

### Layout directives
differential pair; net class DIFF120; differential pair class DIFF120: AUX_N, AUX_P, COM_N, COM_P, H_RS485_N, H_RS485_P, RS485_N, RS485_P

### Notes on the sheet
- Title:
- Size:
- Date:
- A3
- Number:
- Time:
- Revision:
- Sheet
- of
- DEXTRO LABS LTDA
- São Paulo - SP - Brazil
- www.dextrotecnologia.com.br <http://www.dextrotecnologia.com.br>
- contact@dextrotecnologia.com.br
- File:
- (in symbol PTC-FUSE-60V-10mA-0603) °C

### Library data of the parts
C28 C29 = CAP-100nF/50V-0603-X7R-MLCC: as C2 on sheet ALLPRINT-CAPBOARD-677512-MCU; LCSC: C14663
D7 D8 = SM712.TCT-ES: as D1 on sheet ALLPRINT-CAPBOARD-677512-MCU; LCSC: C22363671
PTC2-PTC5 = PTC-FUSE-60V-10mA-0603: 60V 10mA 20A 50mA 15Ω 0603 PTC Resettable Fuses ROHS; LCSC: C914088
R30 R32 = RES-100R-1%-100mW-0603: 100mW Thick Film Resistor 75V ±100ppm/℃ ±1% 100Ω 0603 Chip Resistor - Surface Mount ROHS; LCSC: C105588
R31 R33 = RES-120R-1%-500mW-1206: 120Ω ±1% 500mW 1206 Thick Film Resistor; LCSC: C5713417
U7 U8 = MAX485ESA: Low-Power, Slew-Rate-Limited RS-485/RS-422 Transceivers; LCSC: C5279041

## Sheet ALLPRINT-CAPBOARD-677512-POWER.SchDoc
size A3; Organization: Altium Limited; Address1: 3 Minna Close; Address2: Belrose; Address3: NSW 2085; Address4: Australia; DocumentNumber: 5; SheetNumber: 4; SheetTotal: 11
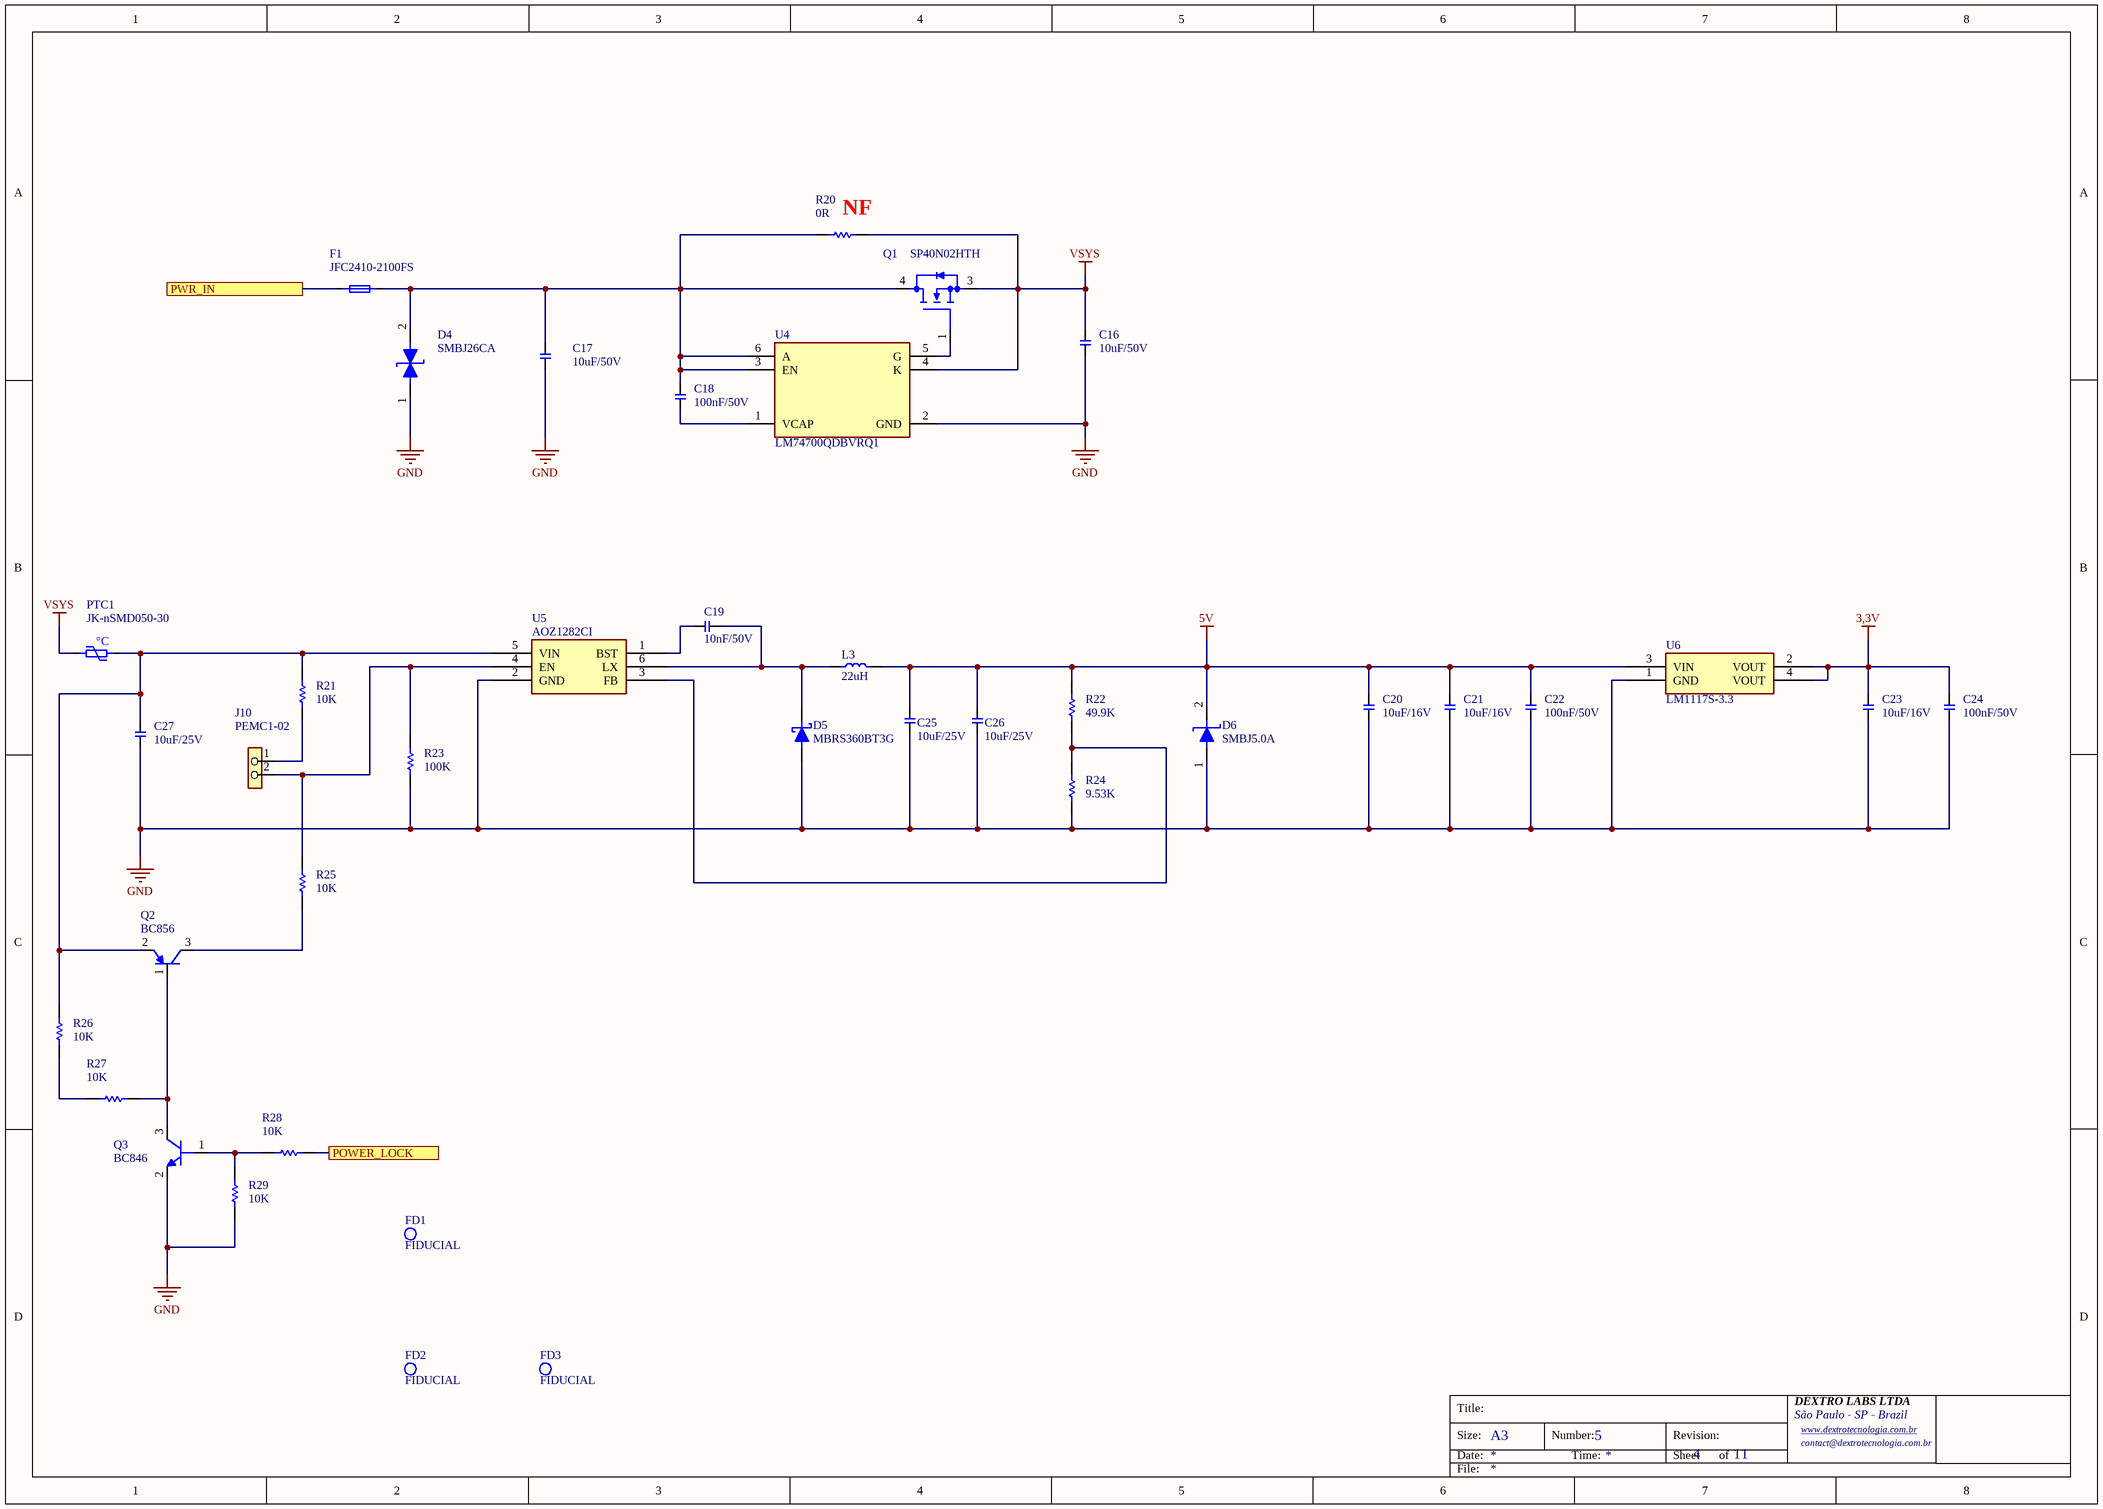
[diagram p6: ALLPRINT-CAPBOARD-677512-POWER.SchDoc]

### Parts
C16  10uF/50V  [CAP-0805]
C17  10uF/50V  [CAP-0805]
C18  100nF/50V  [CAP-0603]
C19  10nF/50V  [CAP-0603]
C20  10uF/16V  [CAP-0603]
C21  10uF/16V  [CAP-0603]
C22  100nF/50V  [CAP-0603]
C23  10uF/16V  [CAP-0603]
C24  100nF/50V  [CAP-0603]
C25  10uF/25V  [CAP-0805]
C26  10uF/25V  [CAP-0805]
C27  10uF/25V  [CAP-0805]
D4  SMBJ26CA  [DO214-AA]
D5  MBRS360BT3G  [DO214-AA]
D6  SMBJ5.0A  [DO214-AA]
F1  JFC2410-2100FS  [FUSE-2410]
FD1  FIDUCIAL  [FIDUCIAL]
FD2  FIDUCIAL  [FIDUCIAL]
FD3  FIDUCIAL  [FIDUCIAL]
J10  PEMC1-02  [PEMC1-02]
L3  22uH  [INDUTOR-6672]
PTC1  JK-nSMD050-30  [PTC-1206]
Q1  SP40N02HTH  [TO-252-2]
Q2  BC856  [SOT23-3]
Q3  BC846  [SOT23-3]
R20  0R  [RES-1206]
R21  10K  [RES-0603]
R22  49.9K  [RES-0603]
R23  100K  [RES-0603]
R24  9.53K  [RES-0603]
R25  10K  [RES-0603]
R26  10K  [RES-0603]
R27  10K  [RES-0603]
R28  10K  [RES-0603]
R29  10K  [RES-0603]
U4  LM74700QDBVRQ1  [SOT23-6]
U5  AOZ1282CI  [SOT23-6]
U6  LM1117S-3.3  [SOT223]

### Ports
POWER_LOCK (see ALLPRINT-CAPBOARD-677512-GENERAL[3C], ALLPRINT-CAPBOARD-677512-MCU[5A]), PWR_IN (see ALLPRINT-CAPBOARD-677512-GENERAL[4C])

### Nets
3,3V: C23.2 C24.2 U6.2(VOUT) U6.4(VOUT)
5V: C20.2 C21.2 C22.2 C25.2 C26.2 D6.2(K) L3.2 R22.2 U6.3(VIN)
GND: C16.1 C17.1 C20.1 C21.1 C22.1 C23.1 C24.1 C25.1 C26.1 C27.1 D4.1(A1) D5.1(A) D6.1(A) Q3.2 R23.1 R24.1 R29.2 U4.2(GND) U5.2(GND) U6.1(GND)
VSYS: C16.2 PTC1.1 Q1.3(S) R20.2 U4.4(K)
NetC17_2: C17.2 C18.2 D4.2(A2) F1.2 Q1.4(D) R20.1 U4.3(EN) U4.6(A)
NetC18_1: C18.1 U4.1(VCAP)
NetC19_1: C19.1 D5.2(K) L3.1 U5.6(LX)
NetC19_2: C19.2 U5.1(BST)
NetC27_2: C27.2 PTC1.2 Q2.2(E) R21.1 R26.2 U5.5(VIN)
NetF1_1: F1.1 ; port PWR_IN
NetJ10_1: J10.1 R21.2
NetJ10_2: J10.2 R23.2 R25.1 U5.4(EN)
NetQ1_1: Q1.1(G]) U4.5(G)
NetQ2_1: Q2.1(B) Q3.3 R27.1
NetQ2_3: Q2.3(C) R25.2
NetQ3_1: Q3.1 R28.2 R29.1
NetR22_1: R22.1 R24.2 U5.3(FB)
NetR26_1: R26.1 R27.2
NetR28_1: R28.1 ; port POWER_LOCK

### Notes on the sheet
- (near R20) NF
- Title:
- Size:
- Date:
- A3
- Number:
- Time:
- Revision:
- Sheet
- of
- DEXTRO LABS LTDA
- São Paulo - SP - Brazil
- www.dextrotecnologia.com.br <http://www.dextrotecnologia.com.br>
- contact@dextrotecnologia.com.br
- File:
- (in symbol PTC-FUSE-30V-500mA-1206) °C

### Library data of the parts
C16 C17 = CAP-10uF/50V-0805-X5R-MLCC: as C1 on sheet ALLPRINT-CAPBOARD-677512-MCU; LCSC: C13585
C18 C22 C24 = CAP-100nF/50V-0603-X7R-MLCC: as C2 on sheet ALLPRINT-CAPBOARD-677512-MCU; LCSC: C14663
C19 = CAP-10nF/50V-0603-X7R-MLCC: as C8 on sheet ALLPRINT-CAPBOARD-677512-MCU; LCSC: C1589
C20 C21 C23 = CAP-10uF/16V-0603-X5R: 16V 10uF X5R ±20% 0603 Multilayer Ceramic Capacitors MLCC - SMD/SMT ROHS; LCSC: C92487
C25-C27 = CAP-10uF/25V-0805-X5R-MLCC: 25V 10uF X5R ±10% 0805 Ceramic Capacitors ROHS; LCSC: C15850
D4 = SMBJ26CA: 28.9V 26V 42.1V 14.2A 600W Bidirectional DO-214AA(SMB) TVS Diodes RoHS; LCSC: C908854
D5 = DIODE-SCHOTTKY-60V-3A-MBRS360BT3G: 125A 60V 630mV@3A 3A SMB(DO-214AA) Single Diodes RoHS; LCSC: C59027
D6 = SMBJ5.0A: 65.3A 600W 9.2V 6.4V Unidirectional 5V DO-214AA TVS Diodes RoHS; LCSC: C83333
F1 = FUSE-125V-10A-2410: 125V Surface Mount Fuse 10A 2410 Fuses RoHS; LCSC: C136374
J10 = PEMC1-02: CONECTOR PASSO 2,5mm / 250VCA / 3A / 10mOHMS
L3 = FIXED-INDUCTOR-SMD-22uH-7.2X6.6mm-2.6A-110mΩ: 2.6A 22uH ±20% 110mΩ SMD,7.2x6.6mm Fixed Inductors RoHS; LCSC: C5189963
PTC1 = PTC-FUSE-30V-500mA-1206: as PTC6 on sheet ALLPRINT-CAPBOARD-677512-SIGNAL-OUTPUTS; LCSC: C720075
Q1 = TRAN-MOSFET-N-CHAN-40V-130A-DPAK: 40V 130A 2.5mΩ@10V 125W TO-252 Single FETs, MOSFETs RoHS; LCSC: C41354884
Q2 = TRANSISTOR-BC856B,215: 65V 220@2mA,5V 250mW 100mA PNP SOT-23 Bipolar (BJT) ROHS; LCSC: C109310
Q3 = TRANSISTOR-BC846B,215-SOT23: as Q5 on sheet ALLPRINT-CAPBOARD-677512-SIGNAL-OUTPUTS; LCSC: C87062
R20 = RES-0R-1%-250mW-1206: 0Ω 250mW 200V Thick Film Resistor ±1% 1206 Chip Resistor - Surface Mount RoHS; LCSC: C137394
R21 R25-R29 = RES-10K-1%-100mW-0603: as R1 on sheet ALLPRINT-CAPBOARD-677512-MCU; LCSC: C98220
R22 = RES-49.9K-1%-100mW-0603: 100mW 49.9kΩ 75V ±100ppm/℃ Thick Film Resistor ±1% 0603 Chip Resistor - Surface Mount ROHS; LCSC: C114624
R23 = RES-100K-1%-100mW-0603: as R34 on sheet ALLPRINT-CAPBOARD-677512-SIGNAL-OUTPUTS; LCSC: C14675
R24 = RES-9.53K-1%-100mW-0603: 100mW 9.53kΩ 75V ±100ppm/℃ Thick Film Resistor ±1% 0603 Chip Resistor - Surface Mount ROHS; LCSC: C2960722
U4 = IC-OR-CONTROLLER-LM74700QDBVRQ1: Low IQ Battery Reverse Protection Ideal Diode Controller; LCSC: C2941042
U5 = AOZ1282CI: Step-down type Adjustable 800mV~36V 1.2A 4.5V~36V SOT-23-6 DC-DC Converters ROHS; LCSC: C111916
U6 = LM1117S-3.3: LCSC: C126027

## Sheet ALLPRINT-CAPBOARD-677512-DIGITAL-OUTPUTS.SchDoc
size A3; Organization: Altium Limited; Address1: 3 Minna Close; Address2: Belrose; Address3: NSW 2085; Address4: Australia; DocumentNumber: 10; SheetNumber: 8; SheetTotal: 11
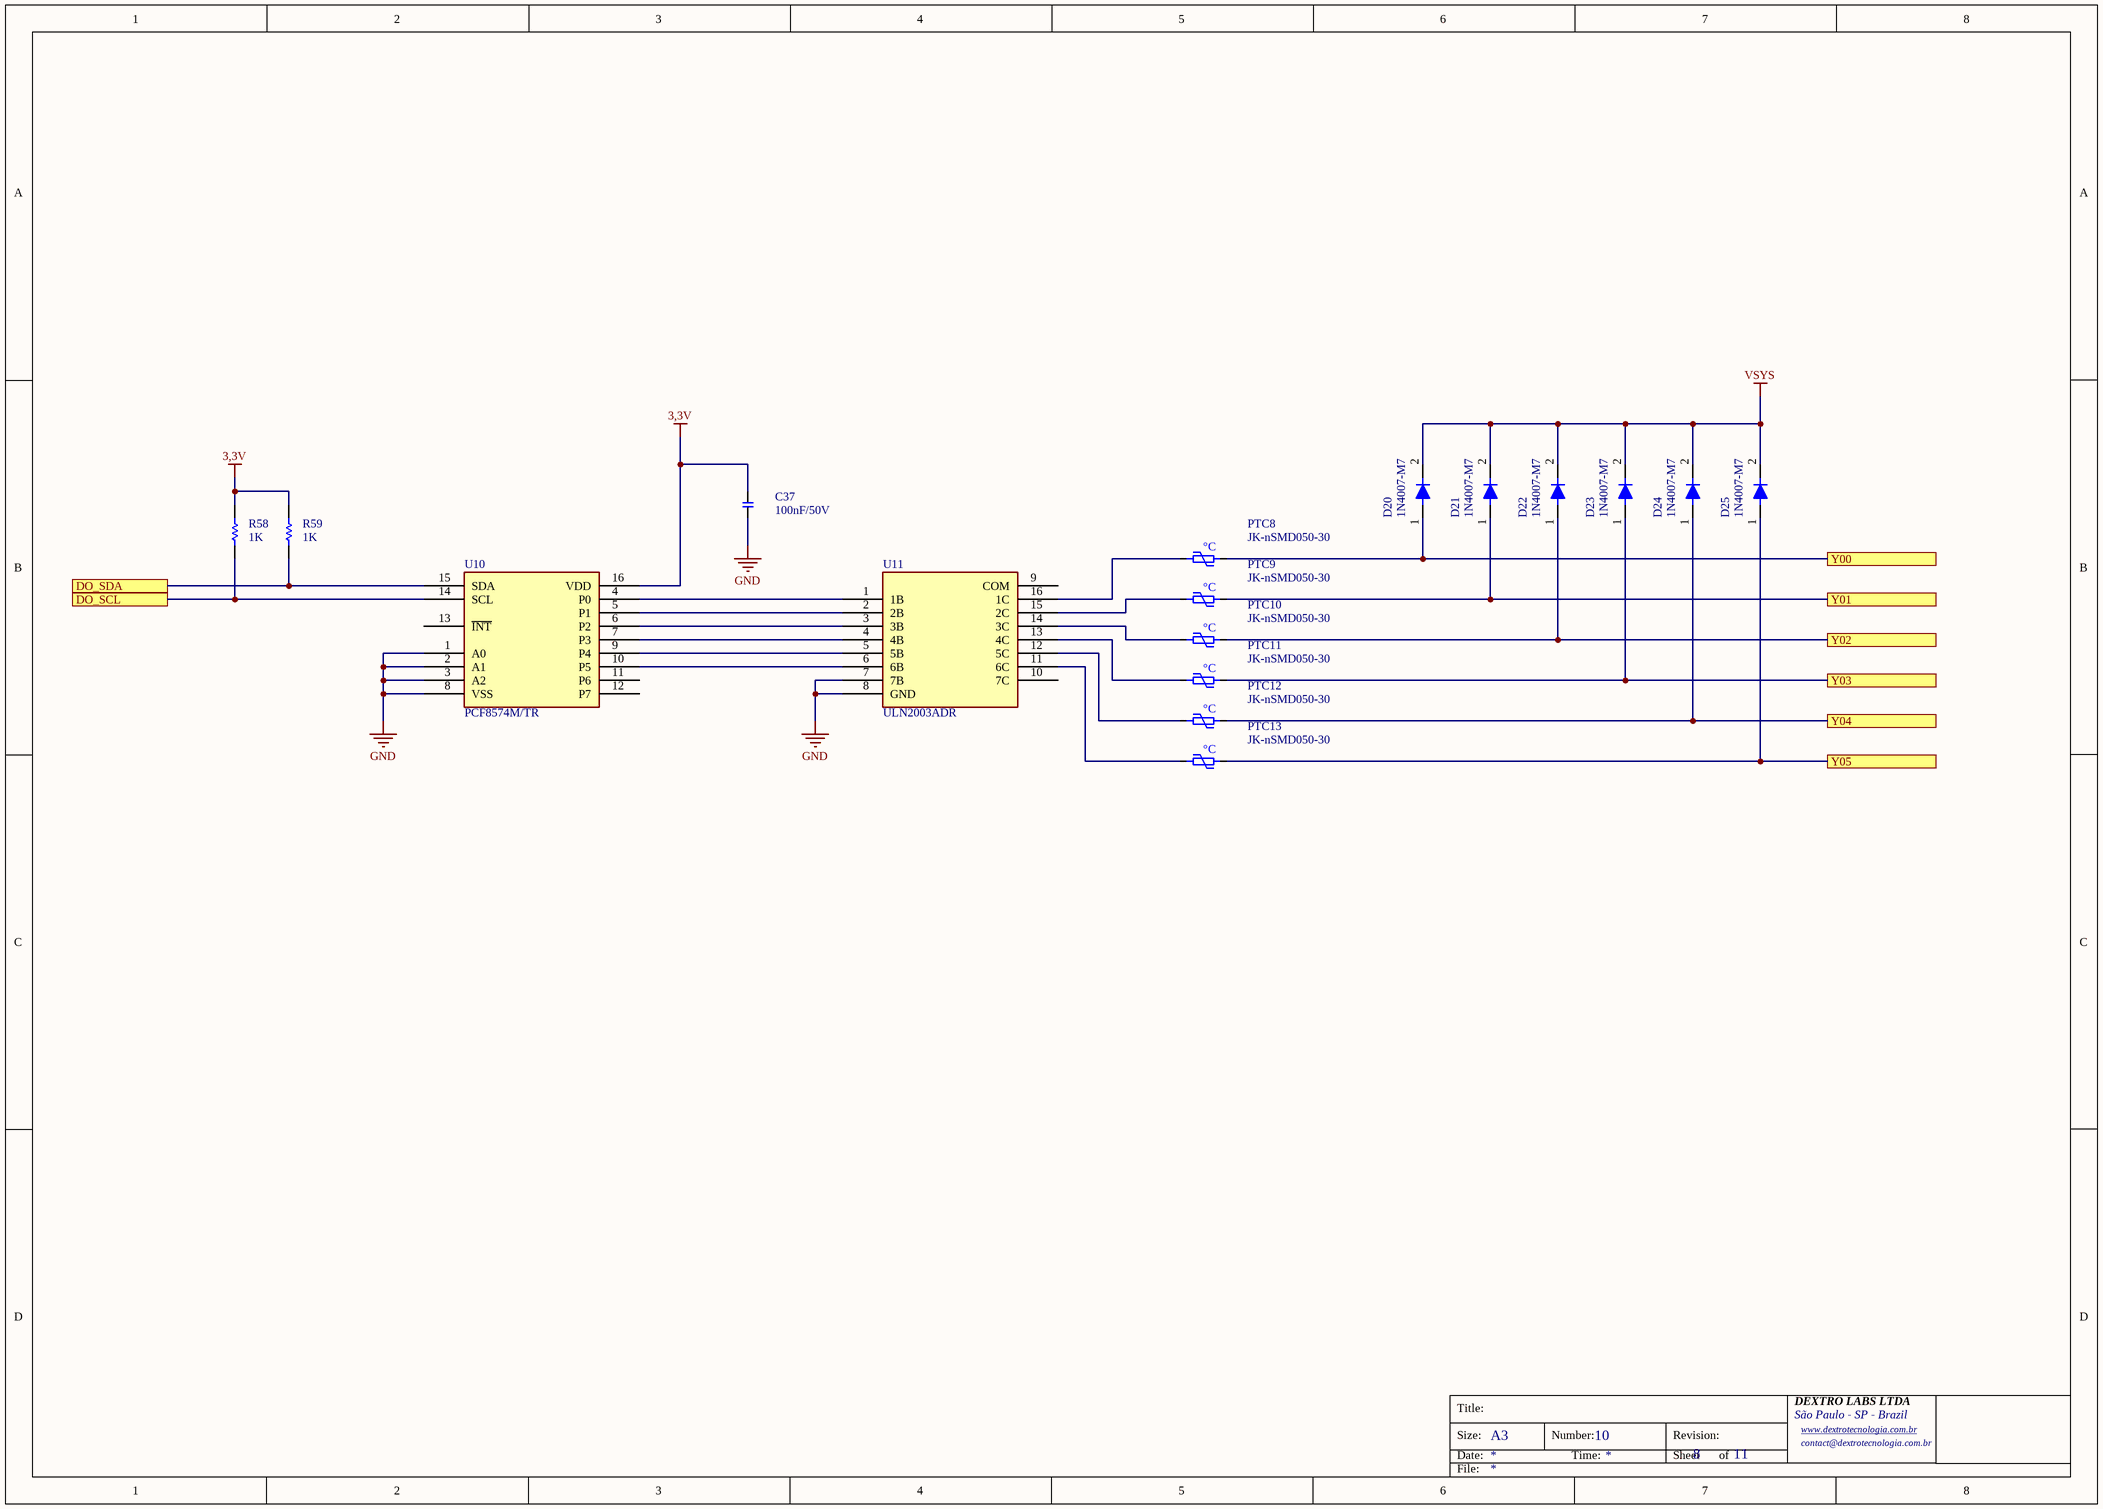
[diagram p7: ALLPRINT-CAPBOARD-677512-DIGITAL-OUTPUTS.SchDoc]

### Parts
C37  100nF/50V  [CAP-0603]
D20  1N4007-M7  [SMA]
D21  1N4007-M7  [SMA]
D22  1N4007-M7  [SMA]
D23  1N4007-M7  [SMA]
D24  1N4007-M7  [SMA]
D25  1N4007-M7  [SMA]
PTC8  JK-nSMD050-30  [PTC-1206]
PTC9  JK-nSMD050-30  [PTC-1206]
PTC10  JK-nSMD050-30  [PTC-1206]
PTC11  JK-nSMD050-30  [PTC-1206]
PTC12  JK-nSMD050-30  [PTC-1206]
PTC13  JK-nSMD050-30  [PTC-1206]
R58  1K  [RES-0603]
R59  1K  [RES-0603]
U10  PCF8574M/TR  [SOIC-16-3D]
U11  ULN2003ADR  [SOIC-16-3D]

### Ports
DO_SCL (see ALLPRINT-CAPBOARD-677512-GENERAL[3B], ALLPRINT-CAPBOARD-677512-MCU[5B]), DO_SDA (see ALLPRINT-CAPBOARD-677512-GENERAL[3A], ALLPRINT-CAPBOARD-677512-MCU[5A]), Y00 (see ALLPRINT-CAPBOARD-677512-GENERAL[4A]), Y01 (see ALLPRINT-CAPBOARD-677512-GENERAL[4B]), Y02 (see ALLPRINT-CAPBOARD-677512-GENERAL[4B]), Y03 (see ALLPRINT-CAPBOARD-677512-GENERAL[4B]), Y04 (see ALLPRINT-CAPBOARD-677512-GENERAL[4B]), Y05 (see ALLPRINT-CAPBOARD-677512-GENERAL[4B])

### Nets
3,3V: C37.2 R58.2 R59.2 U10.16(VDD)
GND: C37.1 U10.1(A0) U10.2(A1) U10.3(A2) U10.8(VSS) U11.7(7B) U11.8(GND)
VSYS: D20.2(K) D21.2(K) D22.2(K) D23.2(K) D24.2(K) D25.2(K)
Y00: D20.1(A1) PTC8.2 ; port Y00
Y01: D21.1(A1) PTC9.2 ; port Y01
Y02: D22.1(A1) PTC10.2 ; port Y02
Y03: D23.1(A1) PTC11.2 ; port Y03
Y04: D24.1(A1) PTC12.2 ; port Y04
Y05: D25.1(A1) PTC13.2 ; port Y05
NetPTC8_1: PTC8.1 U11.16(1C)
NetPTC9_1: PTC9.1 U11.15(2C)
NetPTC10_1: PTC10.1 U11.14(3C)
NetPTC11_1: PTC11.1 U11.13(4C)
NetPTC12_1: PTC12.1 U11.12(5C)
NetPTC13_1: PTC13.1 U11.11(6C)
NetR58_1: R58.1 U10.14(SCL) ; port DO_SCL
NetR59_1: R59.1 U10.15(SDA) ; port DO_SDA
NetU10_4: U10.4(P0) U11.1(1B)
NetU10_5: U10.5(P1) U11.2(2B)
NetU10_6: U10.6(P2) U11.3(3B)
NetU10_7: U10.7(P3) U11.4(4B)
NetU10_9: U10.9(P4) U11.5(5B)
NetU10_10: U10.10(P5) U11.6(6B)

Not connected (* = marked no-connect by the designer): U10 11(P6) 12(P7) 13(~{INT}); U11 9(COM) 10(7C)

### Notes on the sheet
- Title:
- Size:
- Date:
- A3
- Number:
- Time:
- Revision:
- Sheet
- of
- DEXTRO LABS LTDA
- São Paulo - SP - Brazil
- www.dextrotecnologia.com.br <http://www.dextrotecnologia.com.br>
- contact@dextrotecnologia.com.br
- File:
- (in symbol PTC-FUSE-30V-500mA-1206) °C

### Library data of the parts
C37 = CAP-100nF/50V-0603-X7R-MLCC: as C2 on sheet ALLPRINT-CAPBOARD-677512-MCU; LCSC: C14663
D20-D25 = 1N4007-M7: C20754788; LCSC: C20754788
PTC8-PTC13 = PTC-FUSE-30V-500mA-1206: as PTC6 on sheet ALLPRINT-CAPBOARD-677512-SIGNAL-OUTPUTS; LCSC: C720075
R58 R59 = RES-1K-1%-100mW-0603: as R3 on sheet ALLPRINT-CAPBOARD-677512-MCU; LCSC: C22548
U10 = PCF8574M/TR: 8 I2C SOP-16-150mil I/O Expanders RoHS
U11 = ULN2003ADR: 50V 500mA SOIC-16 Bipolar Transistor Arrays RoHS; LCSC: C7512

## Sheet ALLPRINT-CAPBOARD-677512-ENCODER-INPUT.SchDoc
size A3; Organization: Altium Limited; Address1: 3 Minna Close; Address2: Belrose; Address3: NSW 2085; Address4: Australia; DocumentNumber: 12; SheetNumber: 10; SheetTotal: 11
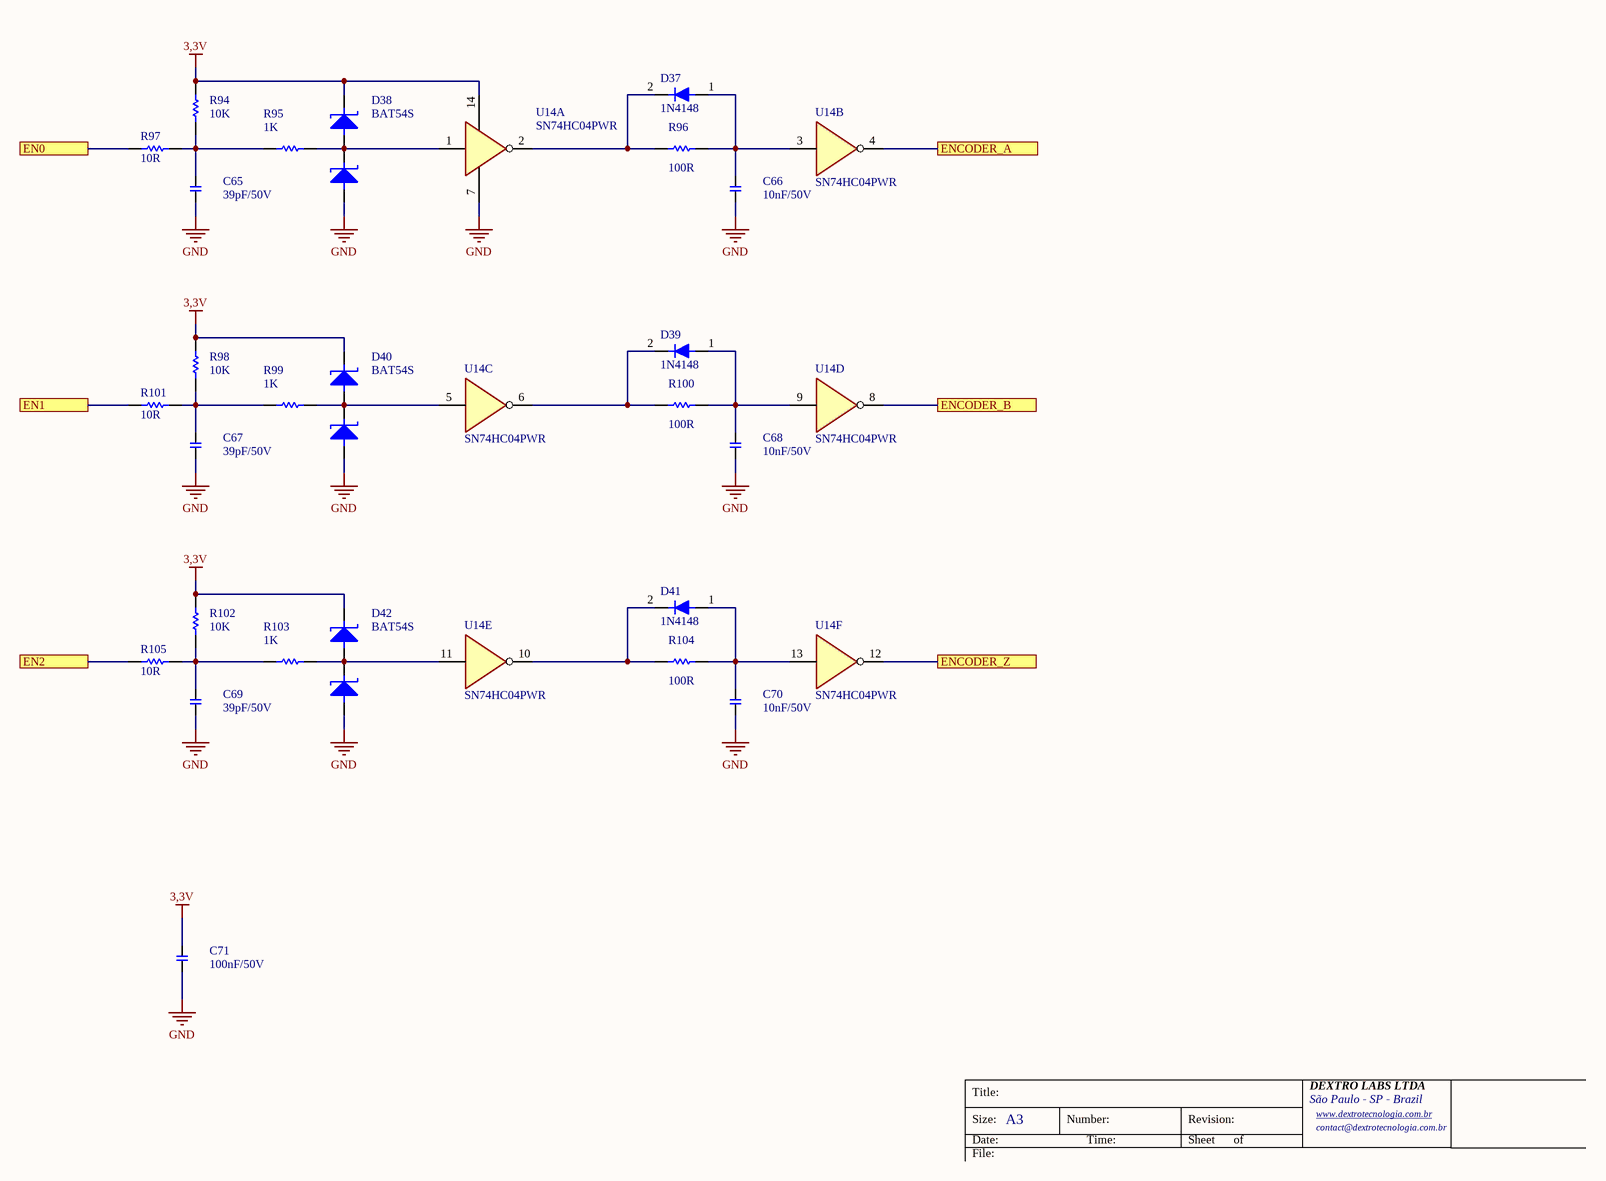
[diagram p8: ALLPRINT-CAPBOARD-677512-ENCODER-INPUT.SchDoc]

### Parts
C65  39pF/50V  [CAP-0603]
C66  10nF/50V  [CAP-0603]
C67  39pF/50V  [CAP-0603]
C68  10nF/50V  [CAP-0603]
C69  39pF/50V  [CAP-0603]
C70  10nF/50V  [CAP-0603]
C71  100nF/50V  [CAP-0603]
D37  1N4148  [SOD123]
D38  BAT54S  [SOT23-3]
D39  1N4148  [SOD123]
D40  BAT54S  [SOT23-3]
D41  1N4148  [SOD123]
D42  BAT54S  [SOT23-3]
R94  10K  [RES-0805]
R95  1K  [RES-0603]
R96  100R  [RES-0603]
R97  10R  [RES-0603]
R98  10K  [RES-0805]
R99  1K  [RES-0603]
R100  100R  [RES-0603]
R101  10R  [RES-0603]
R102  10K  [RES-0805]
R103  1K  [RES-0603]
R104  100R  [RES-0603]
R105  10R  [RES-0603]
U14  SN74HC04PWR  [TSSOP-14]  (parts A,B,C,D,E,F of 6)

### Ports
EN0 (see ALLPRINT-CAPBOARD-677512-GENERAL[4C]), EN1 (see ALLPRINT-CAPBOARD-677512-GENERAL[4C]), EN2 (see ALLPRINT-CAPBOARD-677512-GENERAL[4C]), ENCODER_A (see ALLPRINT-CAPBOARD-677512-GENERAL[3C], ALLPRINT-CAPBOARD-677512-MCU[5B]), ENCODER_B (see ALLPRINT-CAPBOARD-677512-GENERAL[3C], ALLPRINT-CAPBOARD-677512-MCU[5B]), ENCODER_Z (see ALLPRINT-CAPBOARD-677512-GENERAL[3C], ALLPRINT-CAPBOARD-677512-MCU[5B])

### Nets
3,3V: C71.2 D38.2 D40.2 D42.2 R94.2 R98.2 R102.2 U14.14(VCC)
GND: C65.1 C66.1 C67.1 C68.1 C69.1 C70.1 C71.1 D38.1 D40.1 D42.1 U14.7(GND)
EN0: R97.1 ; port EN0
EN1: R101.1 ; port EN1
EN2: R105.1 ; port EN2
NetC65_2: C65.2 R94.1 R95.1 R97.2
NetC66_2: C66.2 D37.1(A1) R96.2 U14.3(4A)
NetC67_2: C67.2 R98.1 R99.1 R101.2
NetC68_2: C68.2 D39.1(A1) R100.2 U14.9
NetC69_2: C69.2 R102.1 R103.1 R105.2
NetC70_2: C70.2 D41.1(A1) R104.2 U14.13
NetD37_2: D37.2(K) R96.1 U14.2
NetD38_3: D38.3 R95.2 U14.1(1A)
NetD39_2: D39.2(K) R100.1 U14.6
NetD40_3: D40.3 R99.2 U14.5
NetD41_2: D41.2(K) R104.1 U14.10
NetD42_3: D42.3 R103.2 U14.11
NetU1_42: U14.4(4Y) ; port ENCODER_A
NetU1_43: U14.8 ; port ENCODER_B
NetU1_45: U14.12 ; port ENCODER_Z

### Notes on the sheet
- Title:
- Size:
- Date:
- A3
- Number:
- Time:
- Revision:
- Sheet
- of
- DEXTRO LABS LTDA
- São Paulo - SP - Brazil
- www.dextrotecnologia.com.br <http://www.dextrotecnologia.com.br>
- contact@dextrotecnologia.com.br
- File:

### Library data of the parts
C65 C67 C69 = CAP-39pF/50V-0603-X7R-MLCC: as C13 on sheet ALLPRINT-CAPBOARD-677512-INDEX-INPUTS; LCSC: C107049
C66 C68 C70 = CAP-10nF/50V-0603-X7R-MLCC: as C8 on sheet ALLPRINT-CAPBOARD-677512-MCU; LCSC: C1589
C71 = CAP-100nF/50V-0603-X7R-MLCC: as C2 on sheet ALLPRINT-CAPBOARD-677512-MCU; LCSC: C14663
D37 D39 D41 = 1N4148: as D13 on sheet ALLPRINT-CAPBOARD-677512-SIGNAL-OUTPUTS; LCSC: C241939
D38 D40 D42 = BAT54S: 30V Dual 200mA 800mV@100mA SOT-23 Schottky Barrier Diodes (SBD) ROHS; LCSC: C916425
R94 R98 R102 = RES-10K-1%-125mW-0805: 100mW Thick Film Resistor 75V ±100ppm/℃ ±1% 10K Chip Resistor - Surface Mount ROHS; LCSC: C84376
R95 R99 R103 = RES-1K-1%-100mW-0603: as R3 on sheet ALLPRINT-CAPBOARD-677512-MCU; LCSC: C22548
R96 R100 R104 = RES-100R-1%-100mW-0603: as R30 on sheet ALLPRINT-CAPBOARD-677512-HEAD-BOARD-COMM; LCSC: C105588
R97 R101 R105 = RES-10R-1%-100mW-0603: as R7 on sheet ALLPRINT-CAPBOARD-677512-MCU; LCSC: C22859
U14 = SN74HC04PWR: as U3 on sheet ALLPRINT-CAPBOARD-677512-INDEX-INPUTS; LCSC: C6810

## Sheet ALLPRINT-CAPBOARD-677512-ISO-PGM.SchDoc
size A3; Organization: Altium Limited; Address1: 3 Minna Close; Address2: Belrose; Address3: NSW 2085; Address4: Australia; DocumentNumber: 13; SheetNumber: 11; SheetTotal: 11
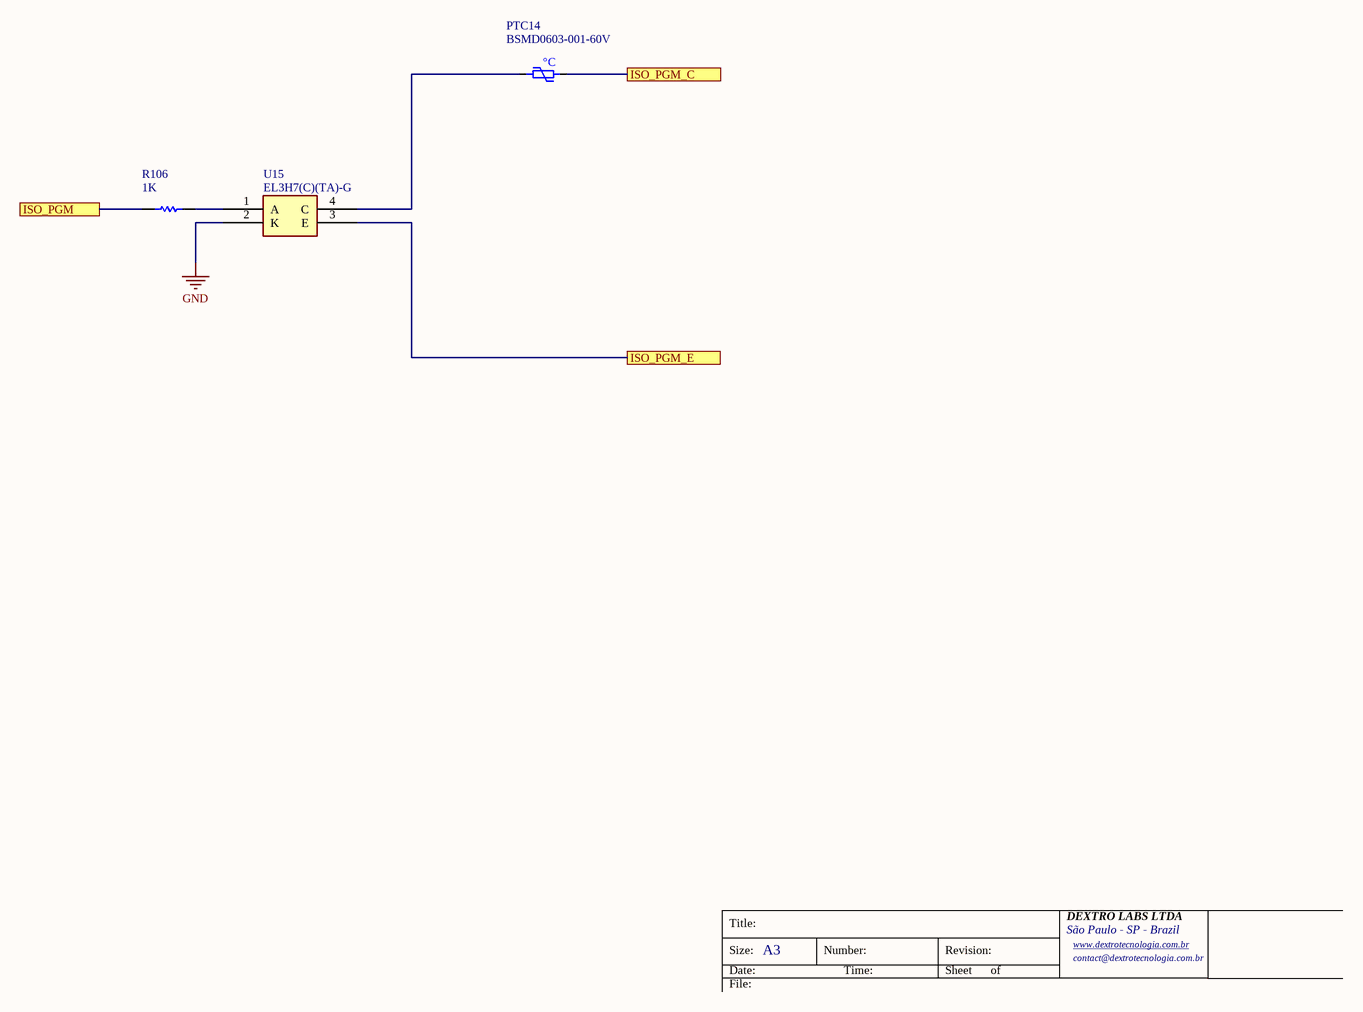
[diagram p9: ALLPRINT-CAPBOARD-677512-ISO-PGM.SchDoc]

### Parts
PTC14  BSMD0603-001-60V  [PTC-0603]
R106  1K  [RES-0603]
U15  EL3H7(C)(TA)-G  [SSOP-4]

### Ports
ISO_PGM (see ALLPRINT-CAPBOARD-677512-GENERAL[3C], ALLPRINT-CAPBOARD-677512-MCU[1B]), ISO_PGM_C (see ALLPRINT-CAPBOARD-677512-GENERAL[4C]), ISO_PGM_E (see ALLPRINT-CAPBOARD-677512-GENERAL[4C])

### Nets
GND: U15.2(K)
ISO_PGM_C: PTC14.2 ; port ISO_PGM_C
ISO_PGM_E: U15.3(E) ; port ISO_PGM_E
NetPTC14_1: PTC14.1 U15.4(C)
NetR106_1: R106.1 ; port ISO_PGM
NetR106_2: R106.2 U15.1(A)

### Notes on the sheet
- Title:
- Size:
- Date:
- A3
- Number:
- Time:
- Revision:
- Sheet
- of
- DEXTRO LABS LTDA
- São Paulo - SP - Brazil
- www.dextrotecnologia.com.br <http://www.dextrotecnologia.com.br>
- contact@dextrotecnologia.com.br
- File:
- (in symbol PTC-FUSE-60V-10mA-0603) °C

### Library data of the parts
PTC14 = PTC-FUSE-60V-10mA-0603: as PTC2 on sheet ALLPRINT-CAPBOARD-677512-HEAD-BOARD-COMM; LCSC: C914088
R106 = RES-1K-1%-100mW-0603: as R3 on sheet ALLPRINT-CAPBOARD-677512-MCU; LCSC: C22548
U15 = EL3H7(C)(TA)-G: as U2 on sheet ALLPRINT-CAPBOARD-677512-INDEX-INPUTS; LCSC: C92243